# Altium project MAIN_BOARD.PrjPcb
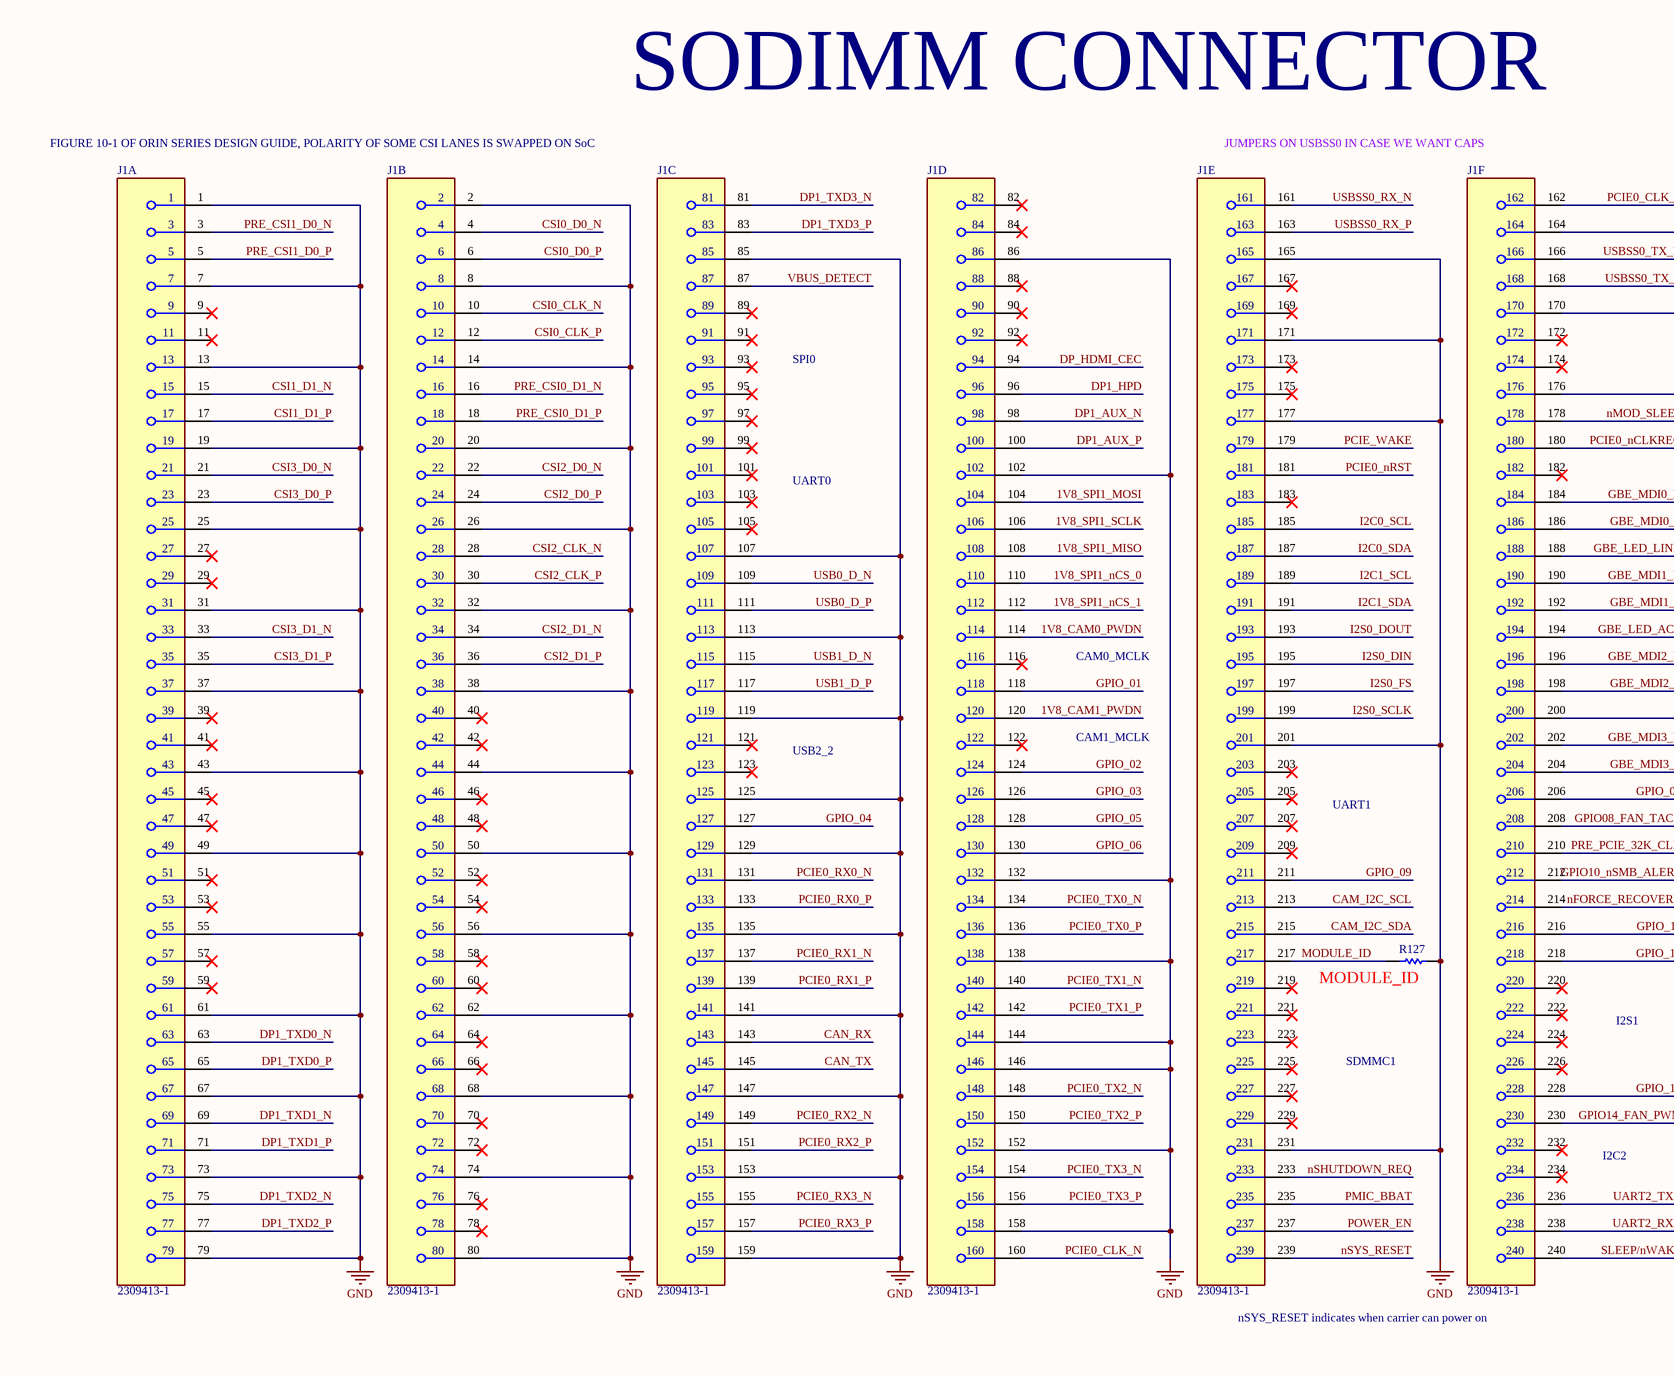
[diagram p0: JETSON.SchDoc, top left]
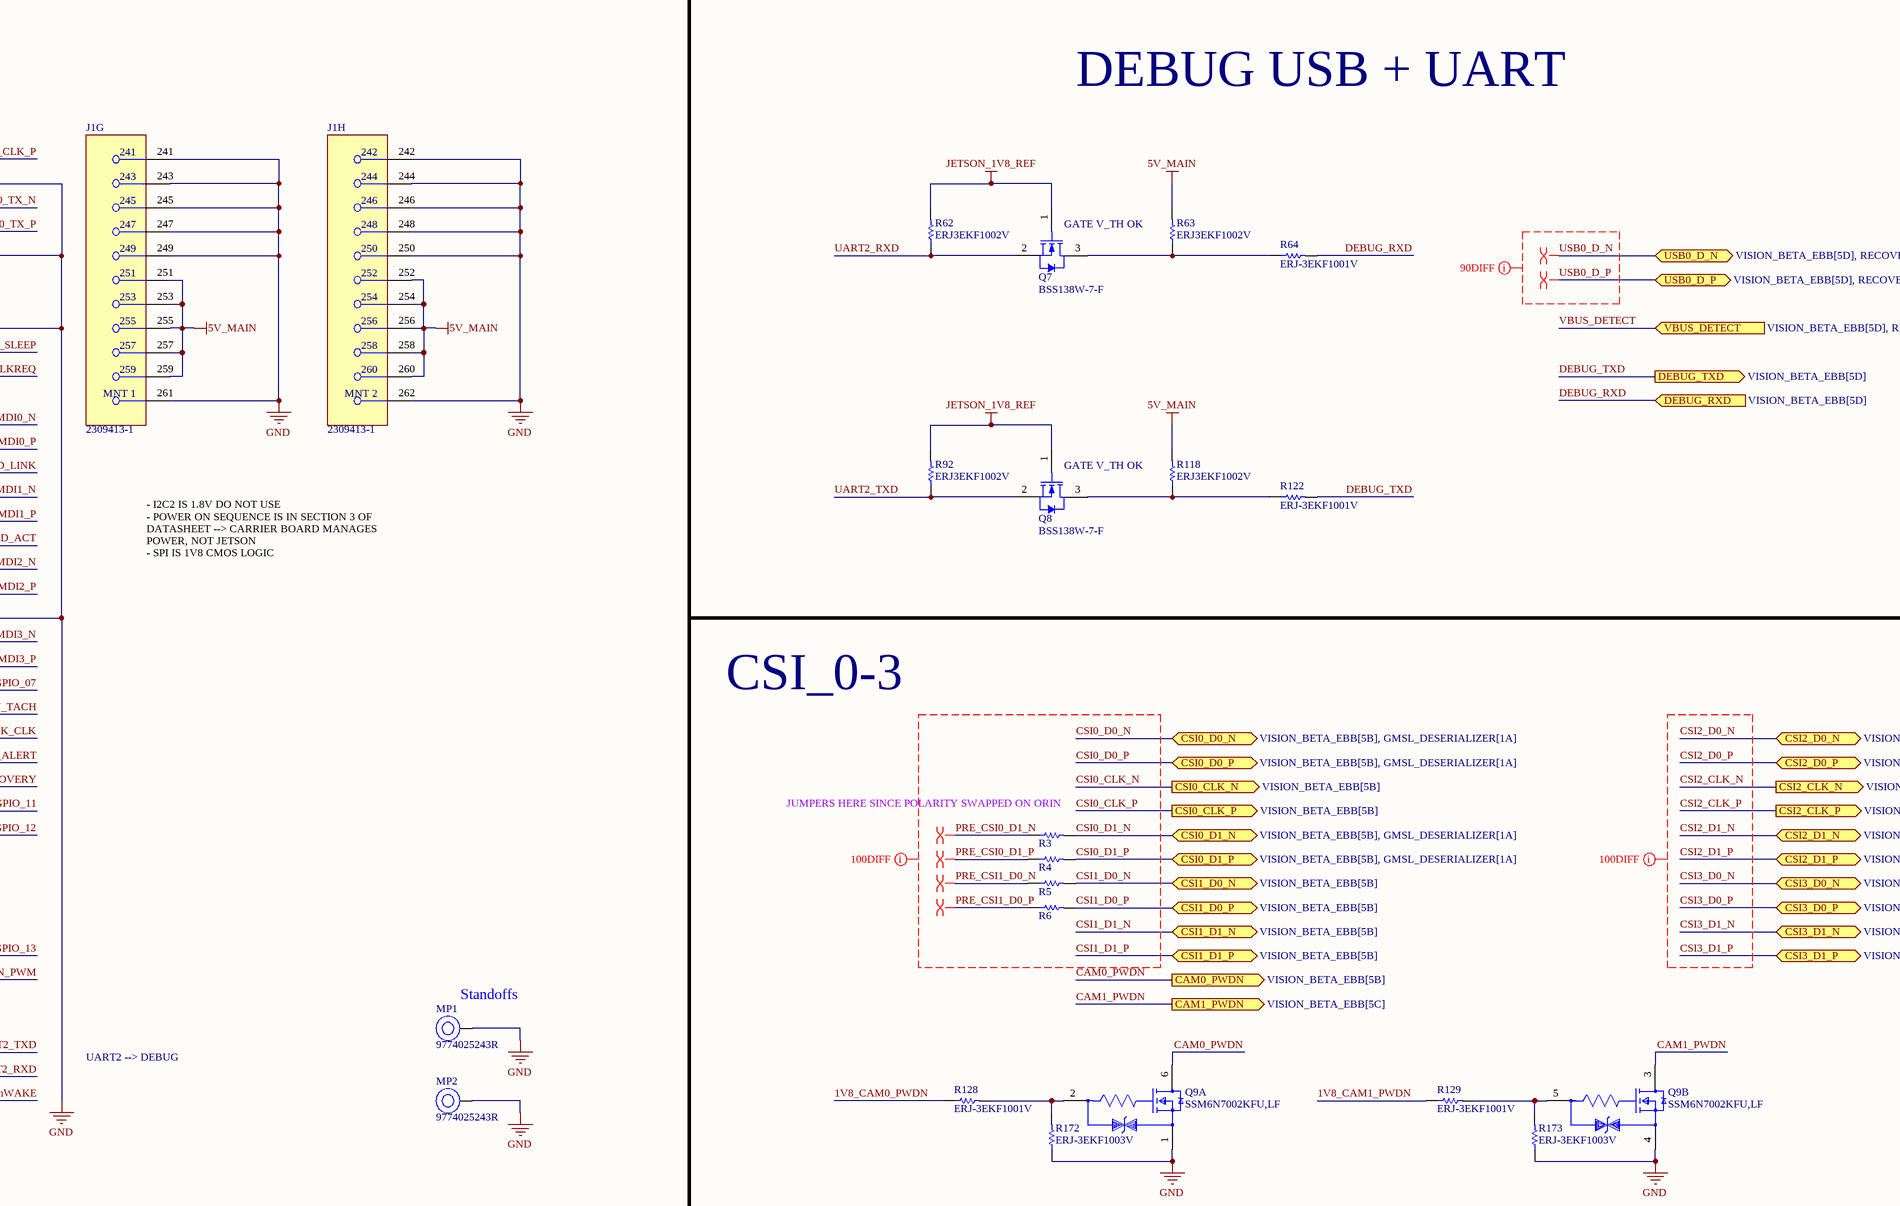
[diagram p1: JETSON.SchDoc, top middle]
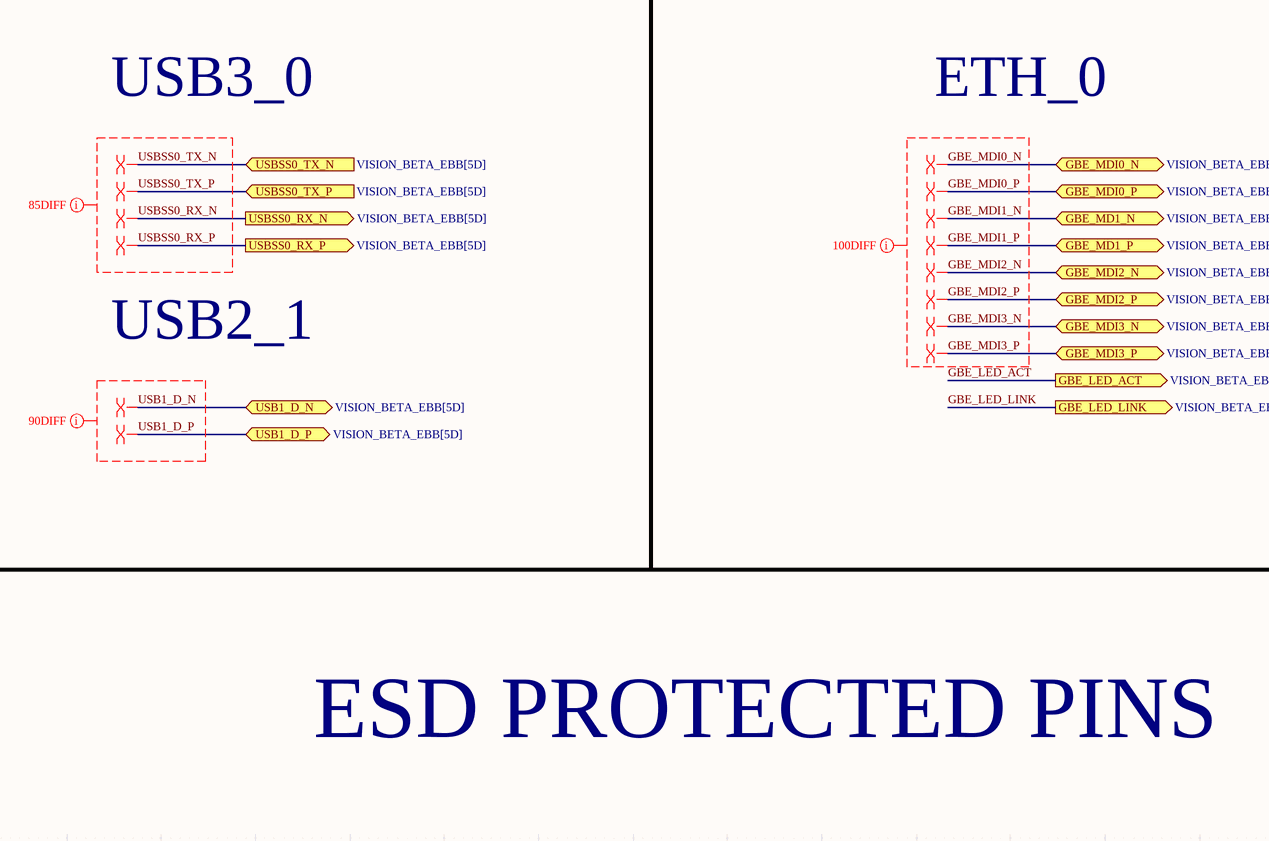
[diagram p2: JETSON.SchDoc, top right]
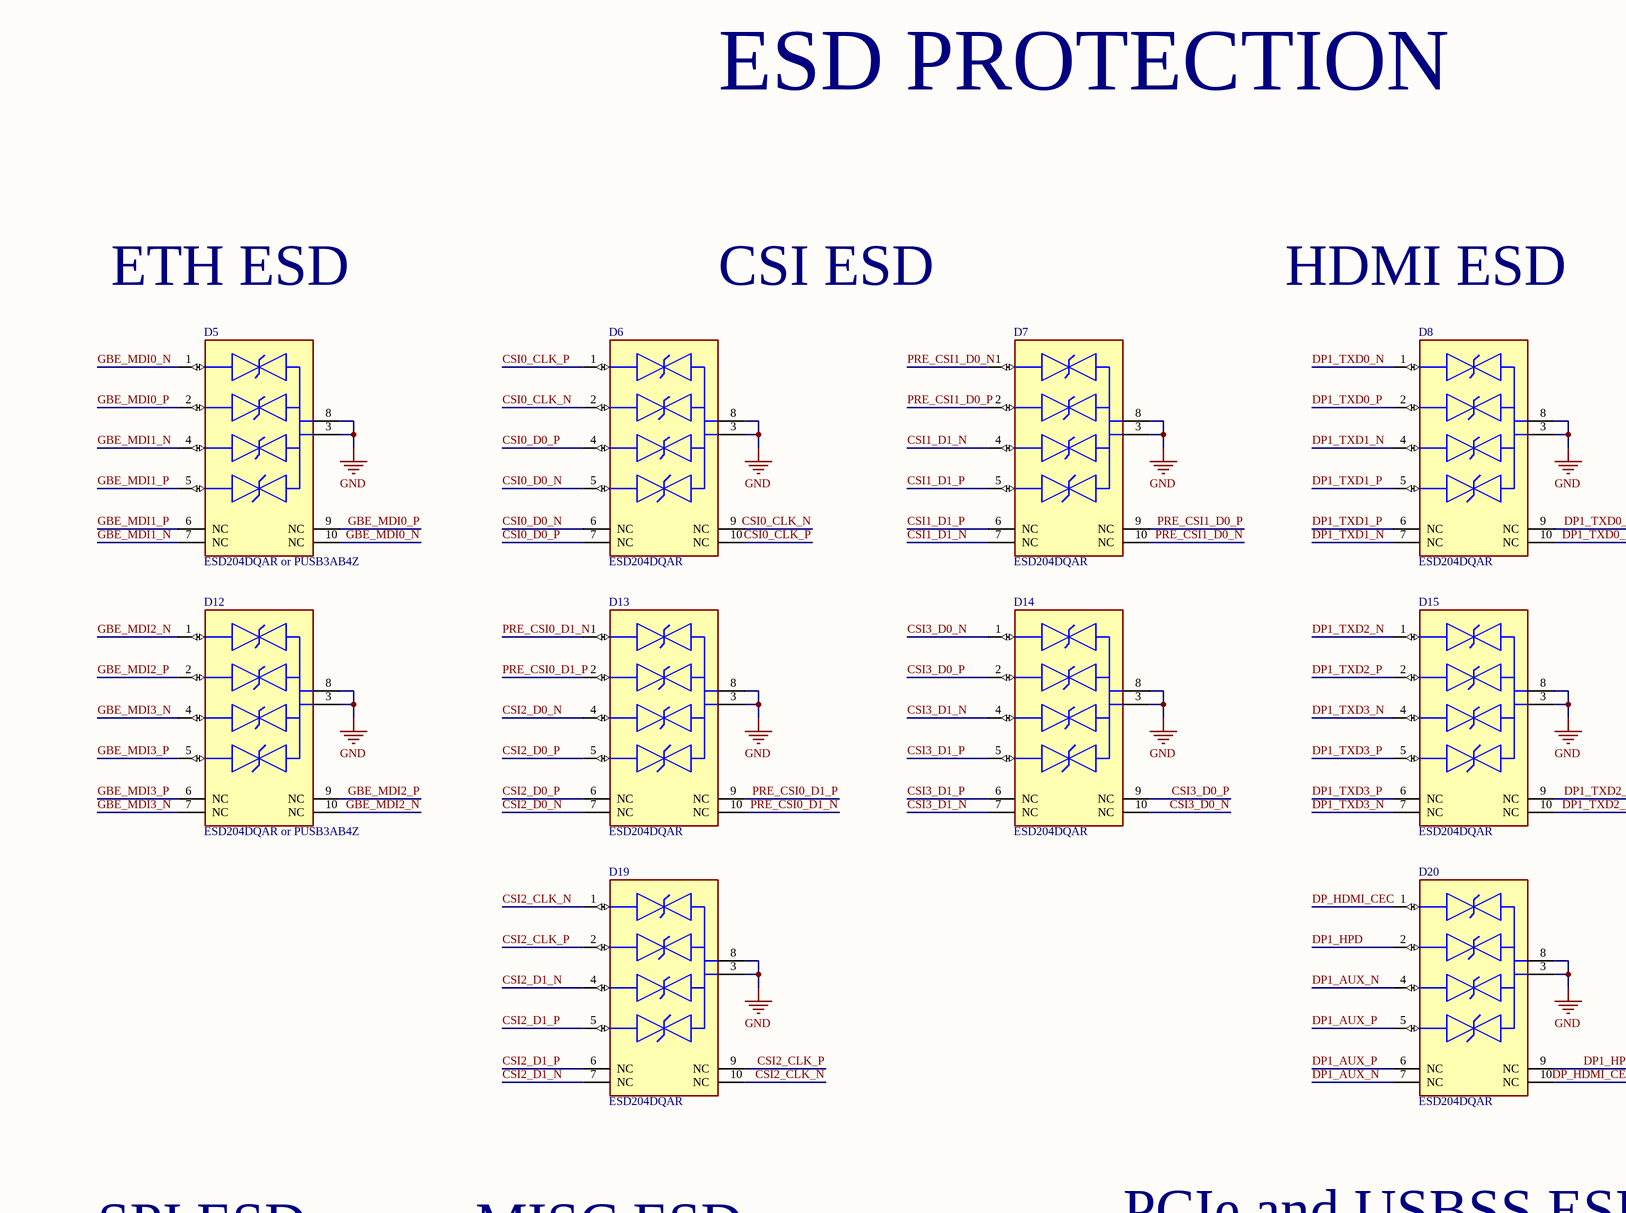
[diagram p3: JETSON.SchDoc, centre left]
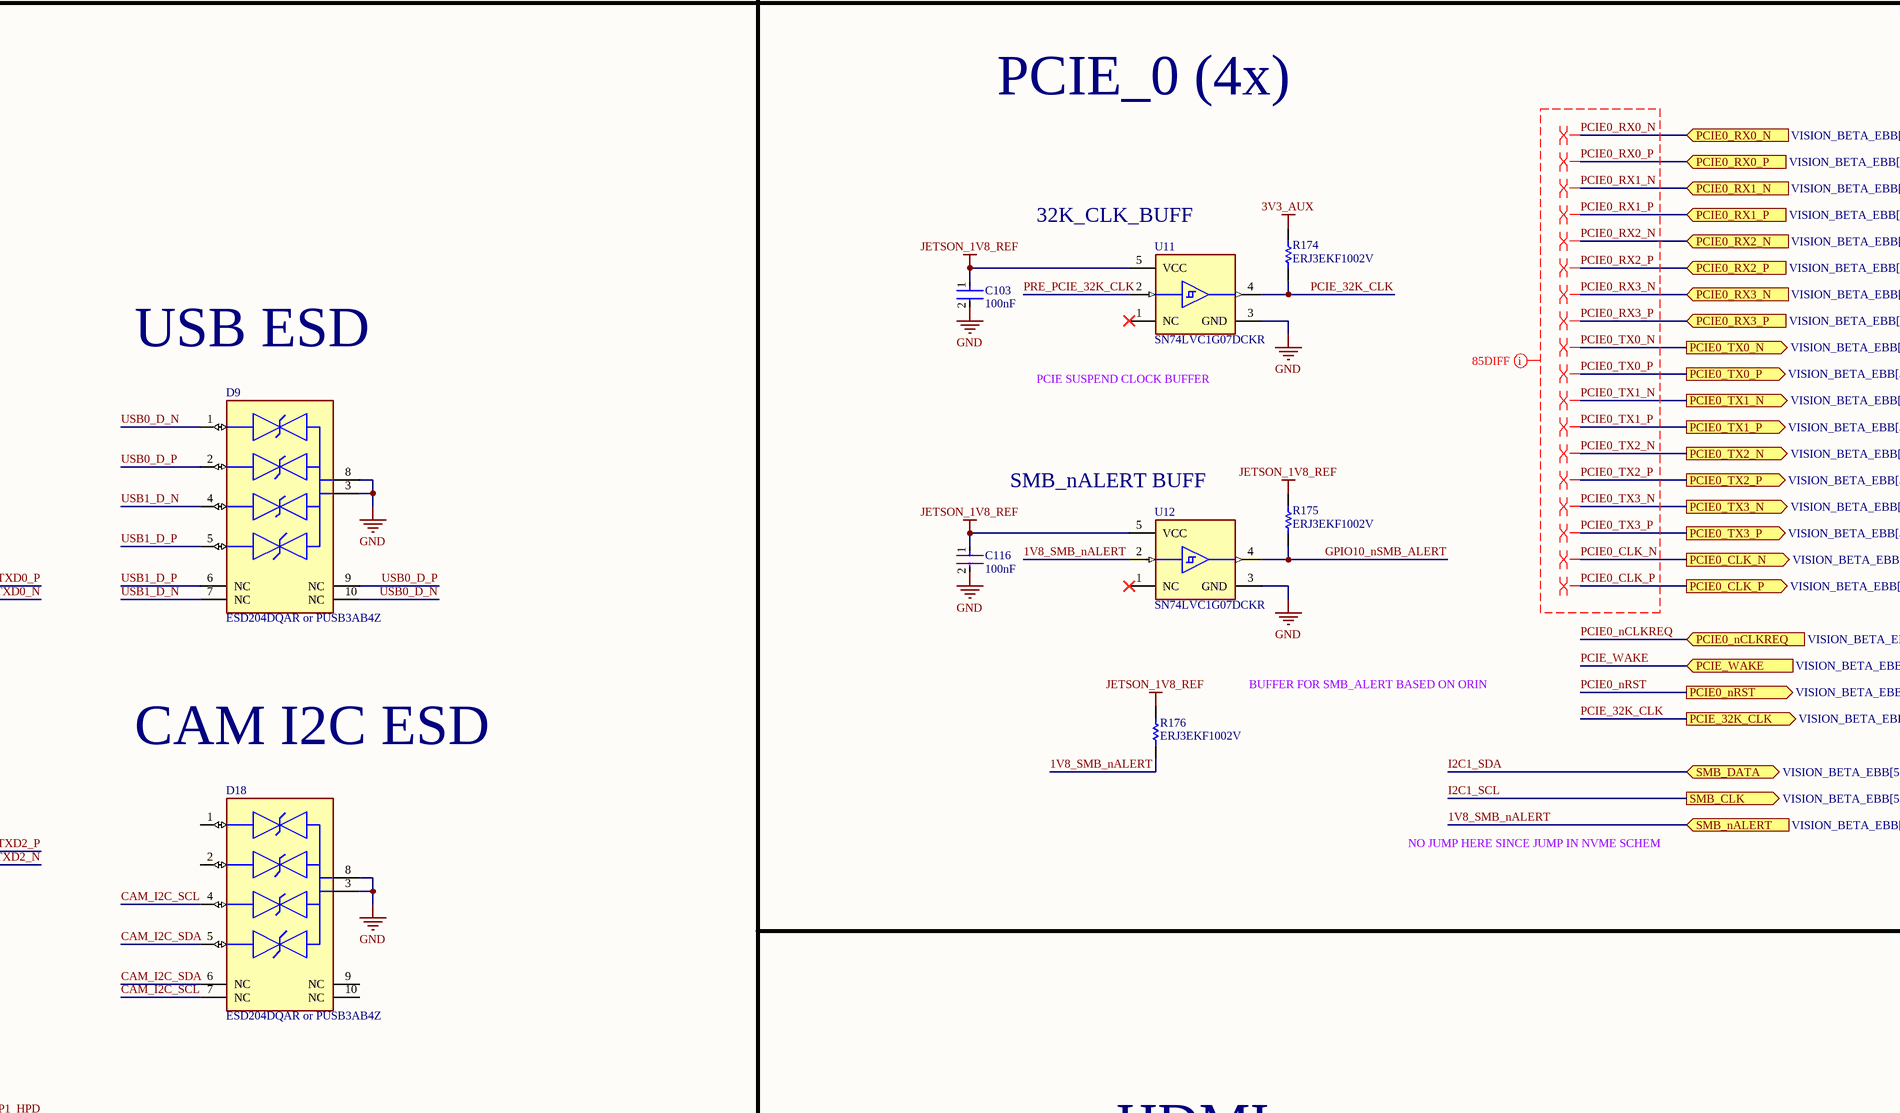
[diagram p4: JETSON.SchDoc, centre middle]
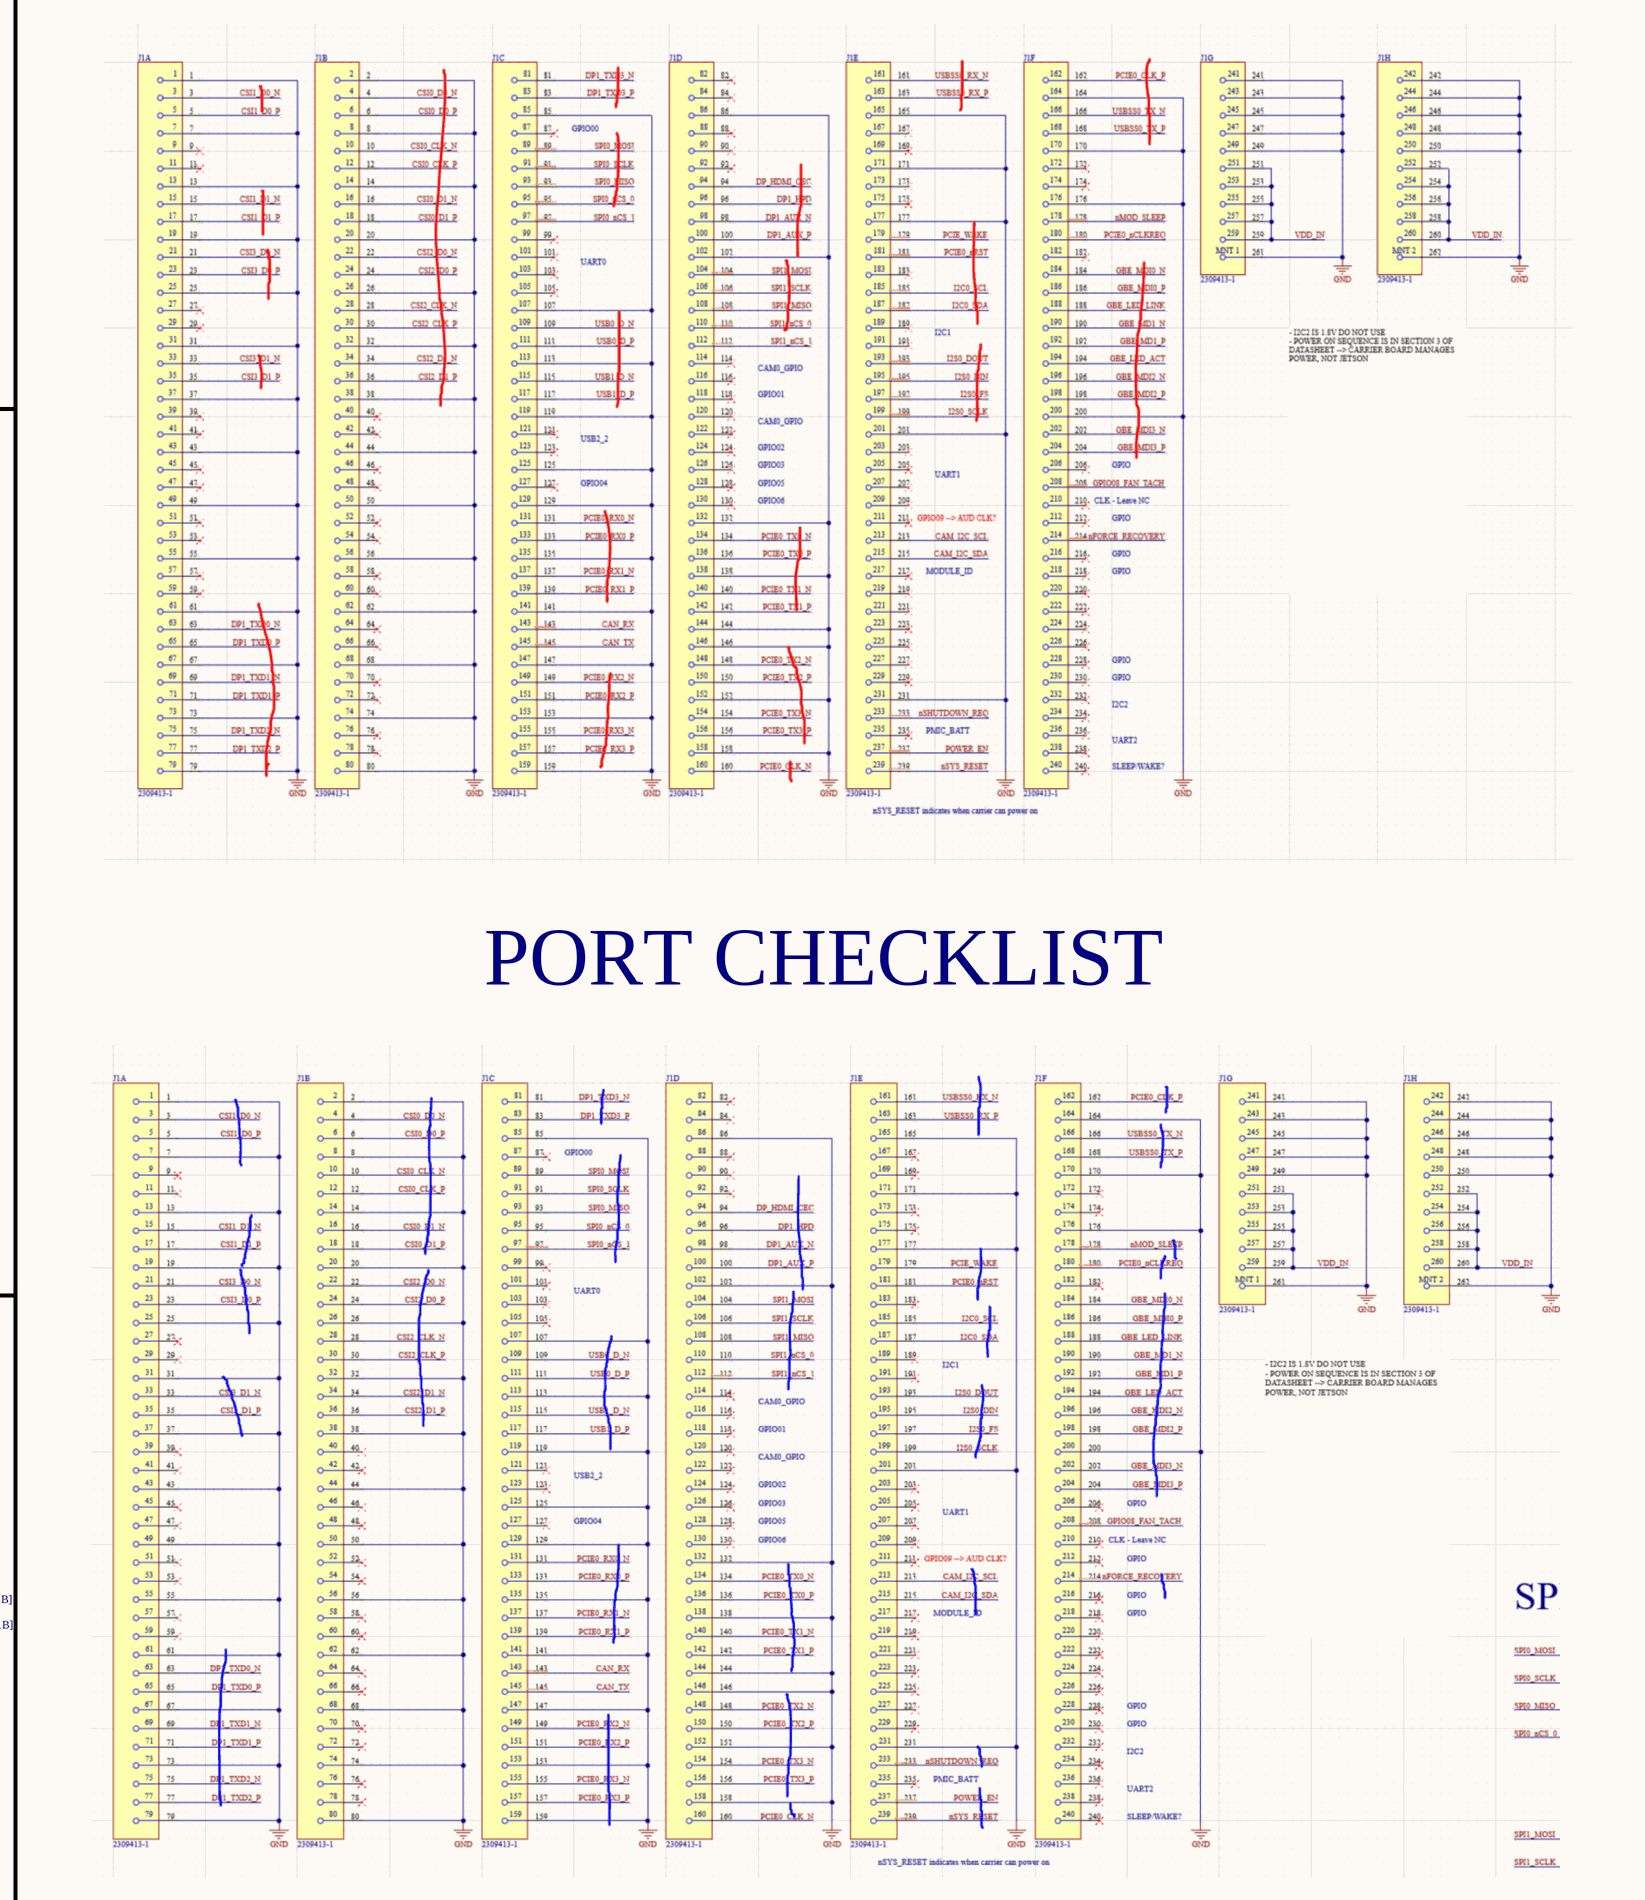
[diagram p5: JETSON.SchDoc, centre right]
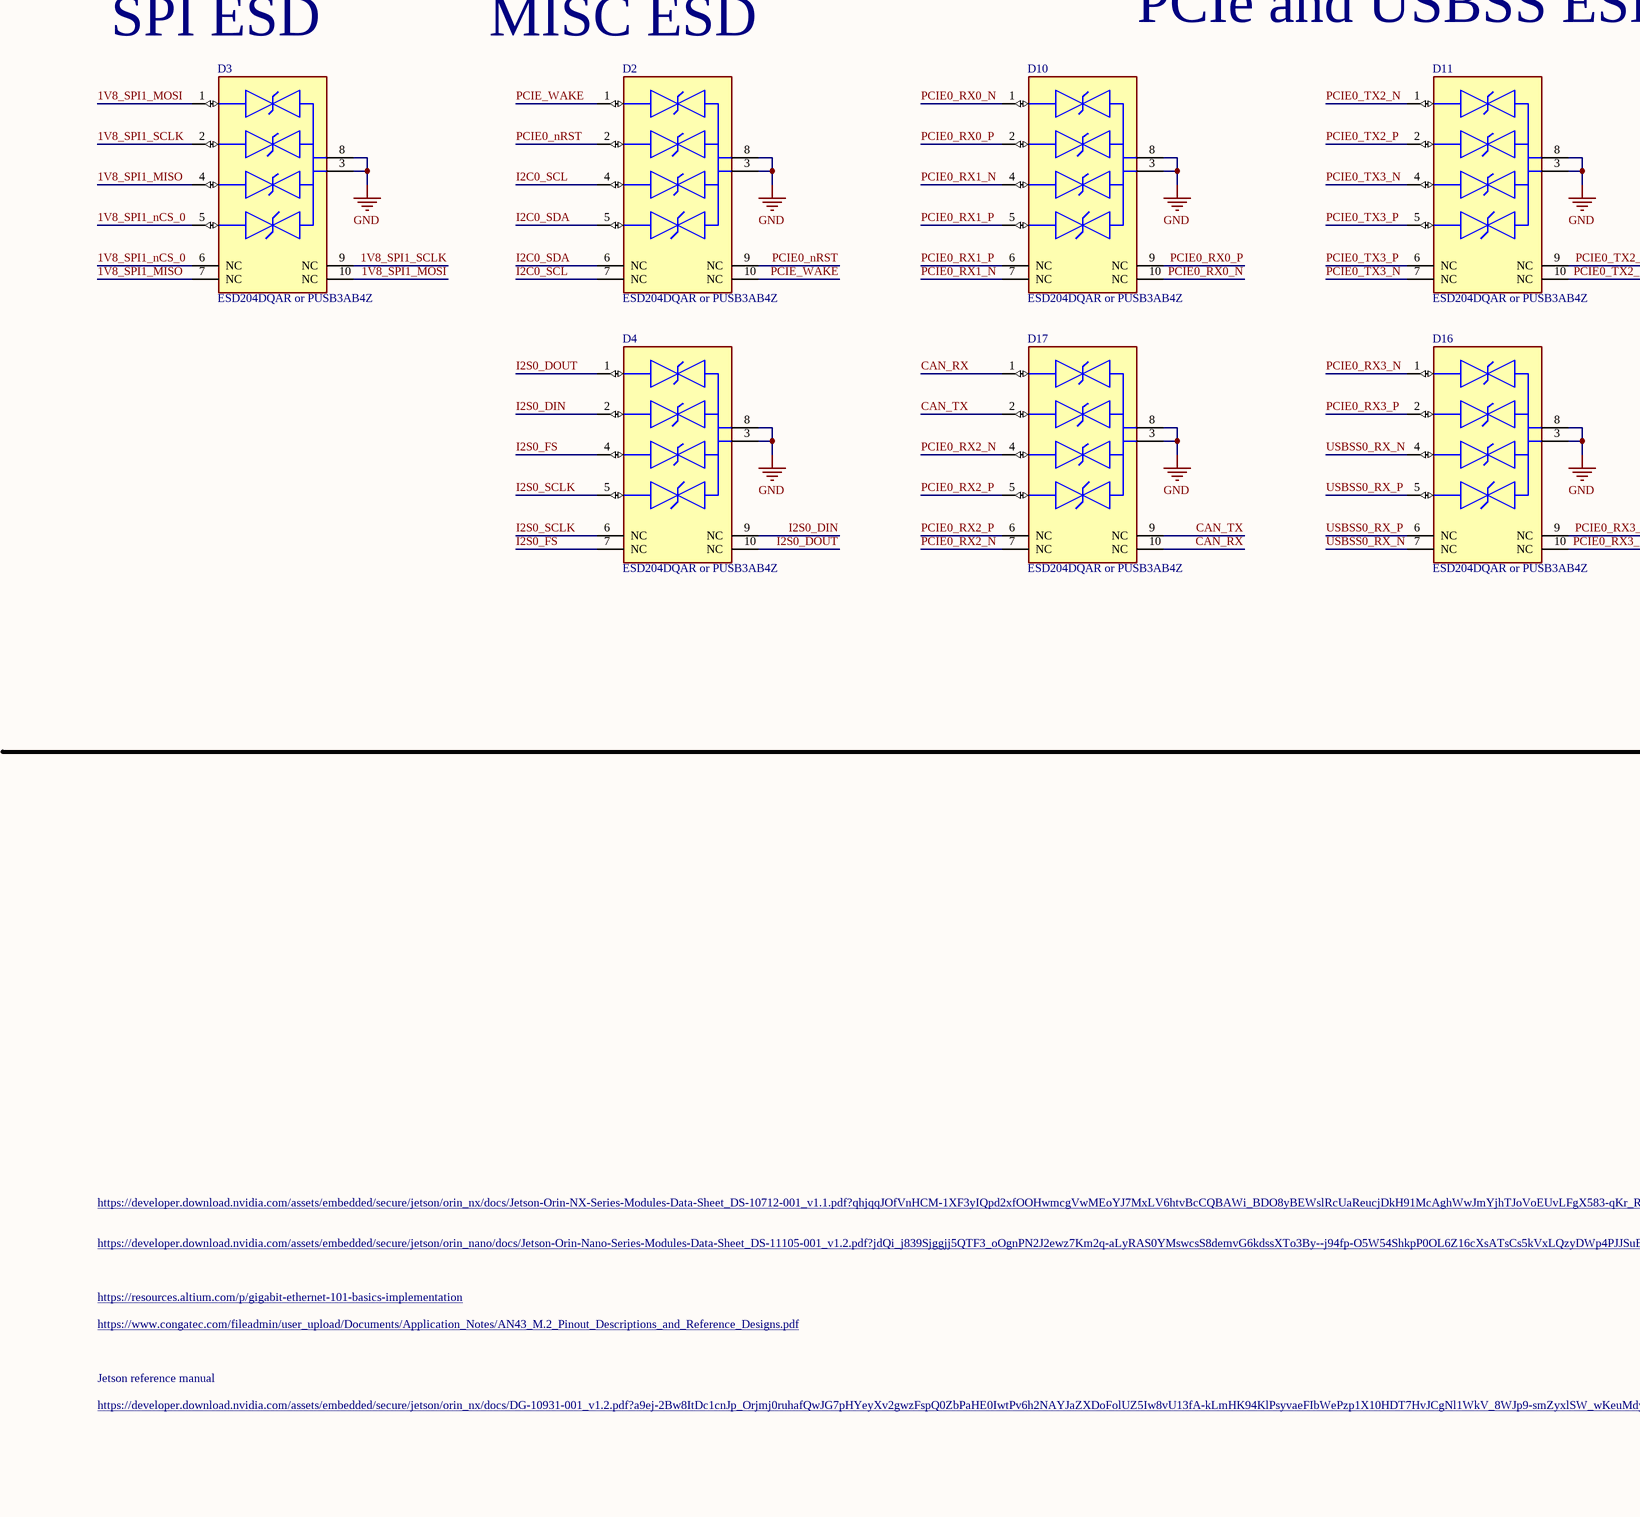
[diagram p6: JETSON.SchDoc, bottom left]
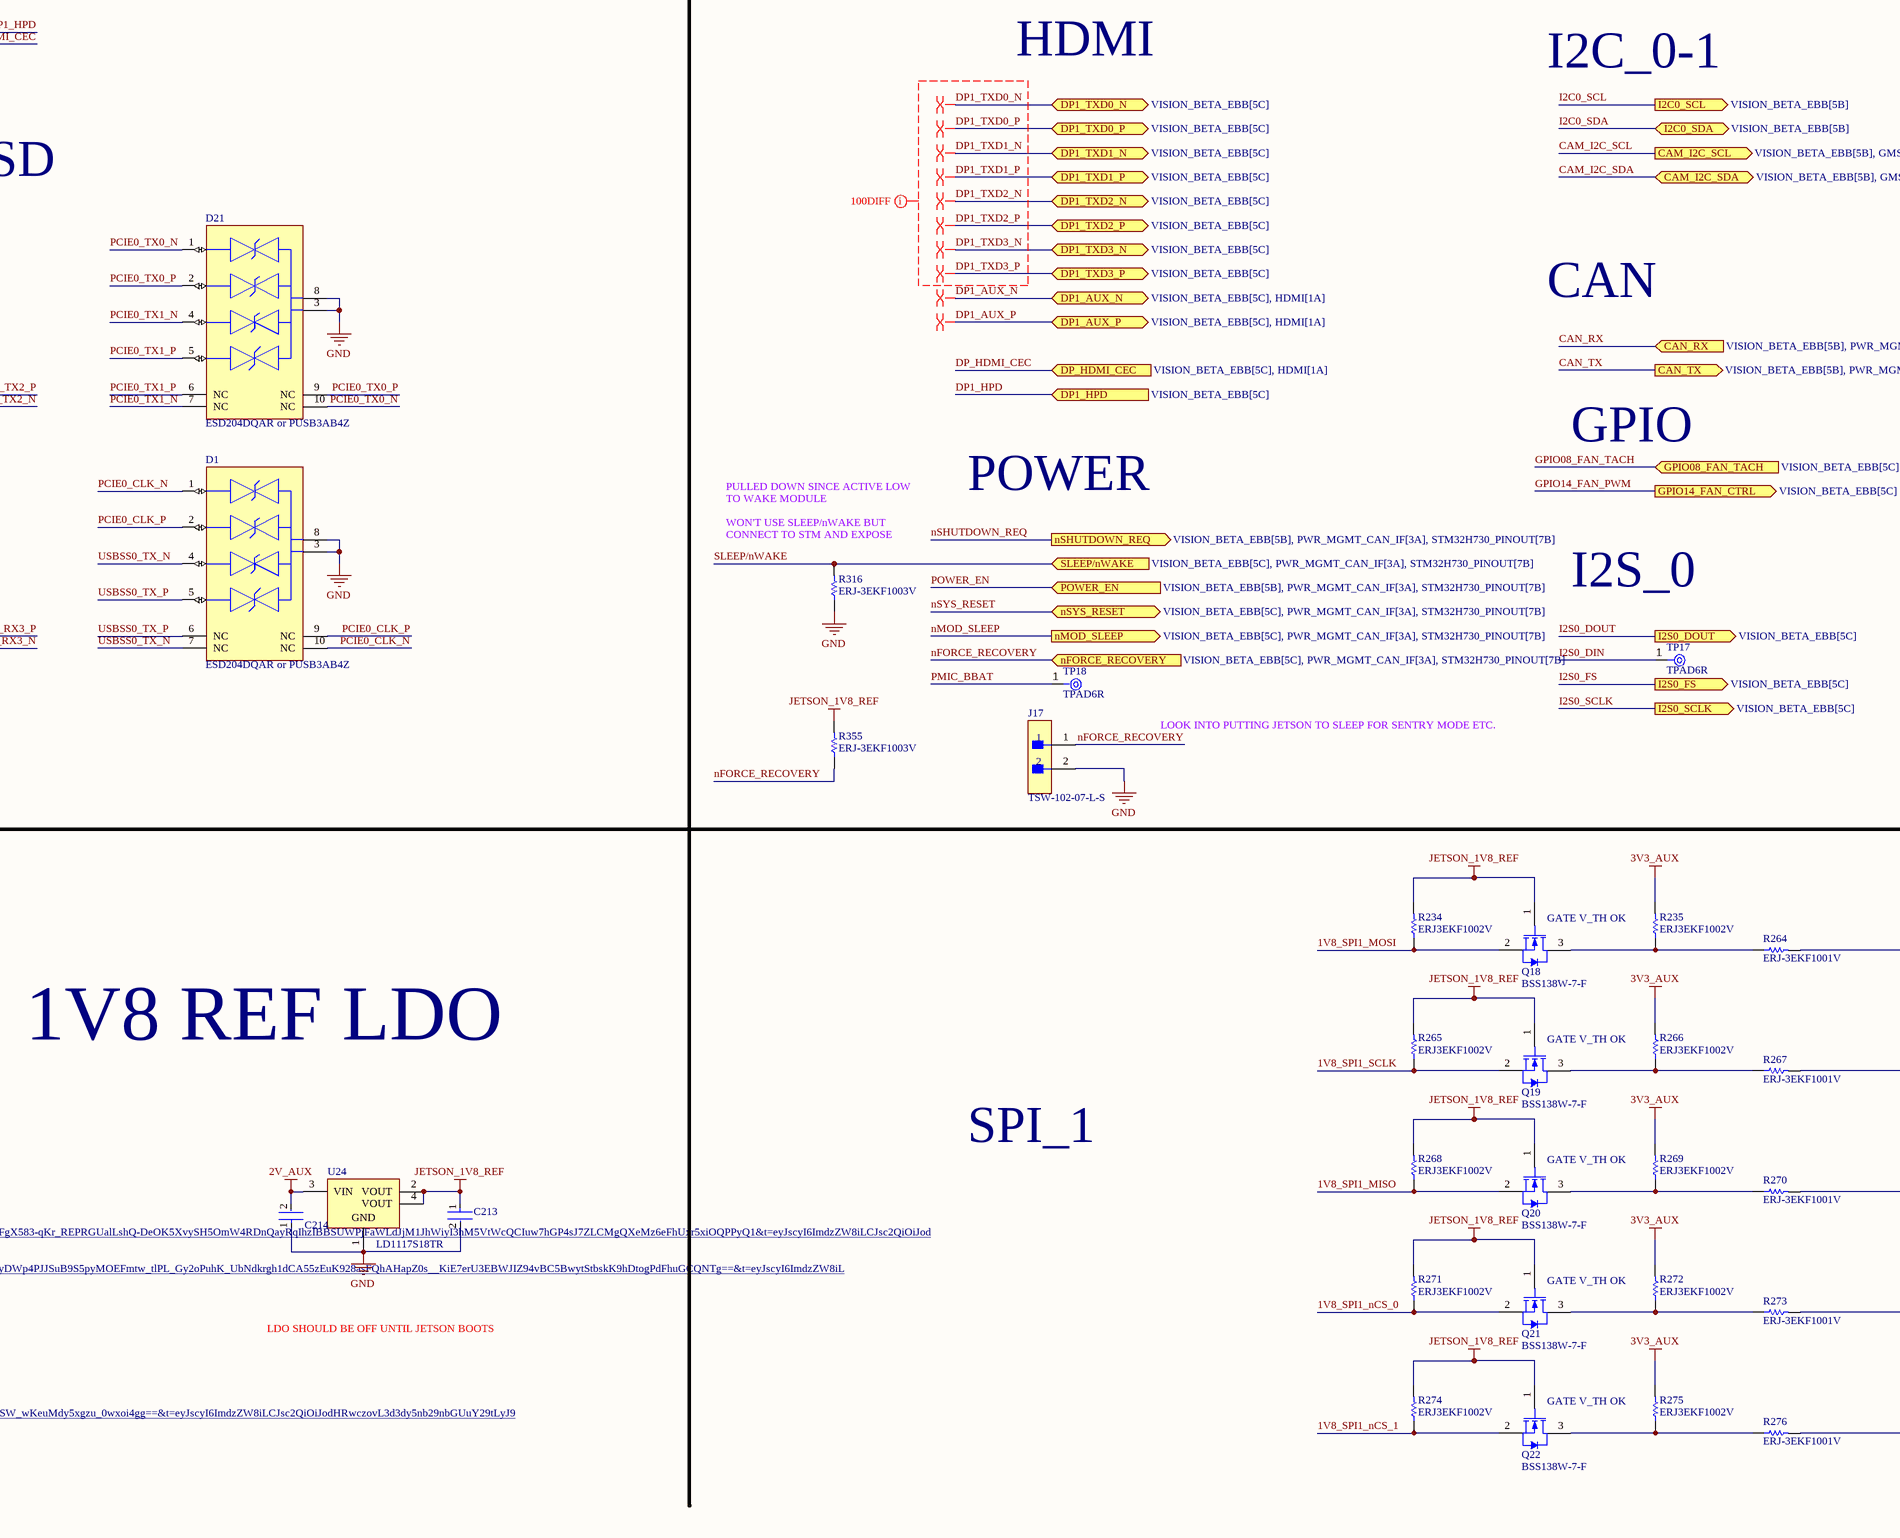
[diagram p7: JETSON.SchDoc, bottom middle]
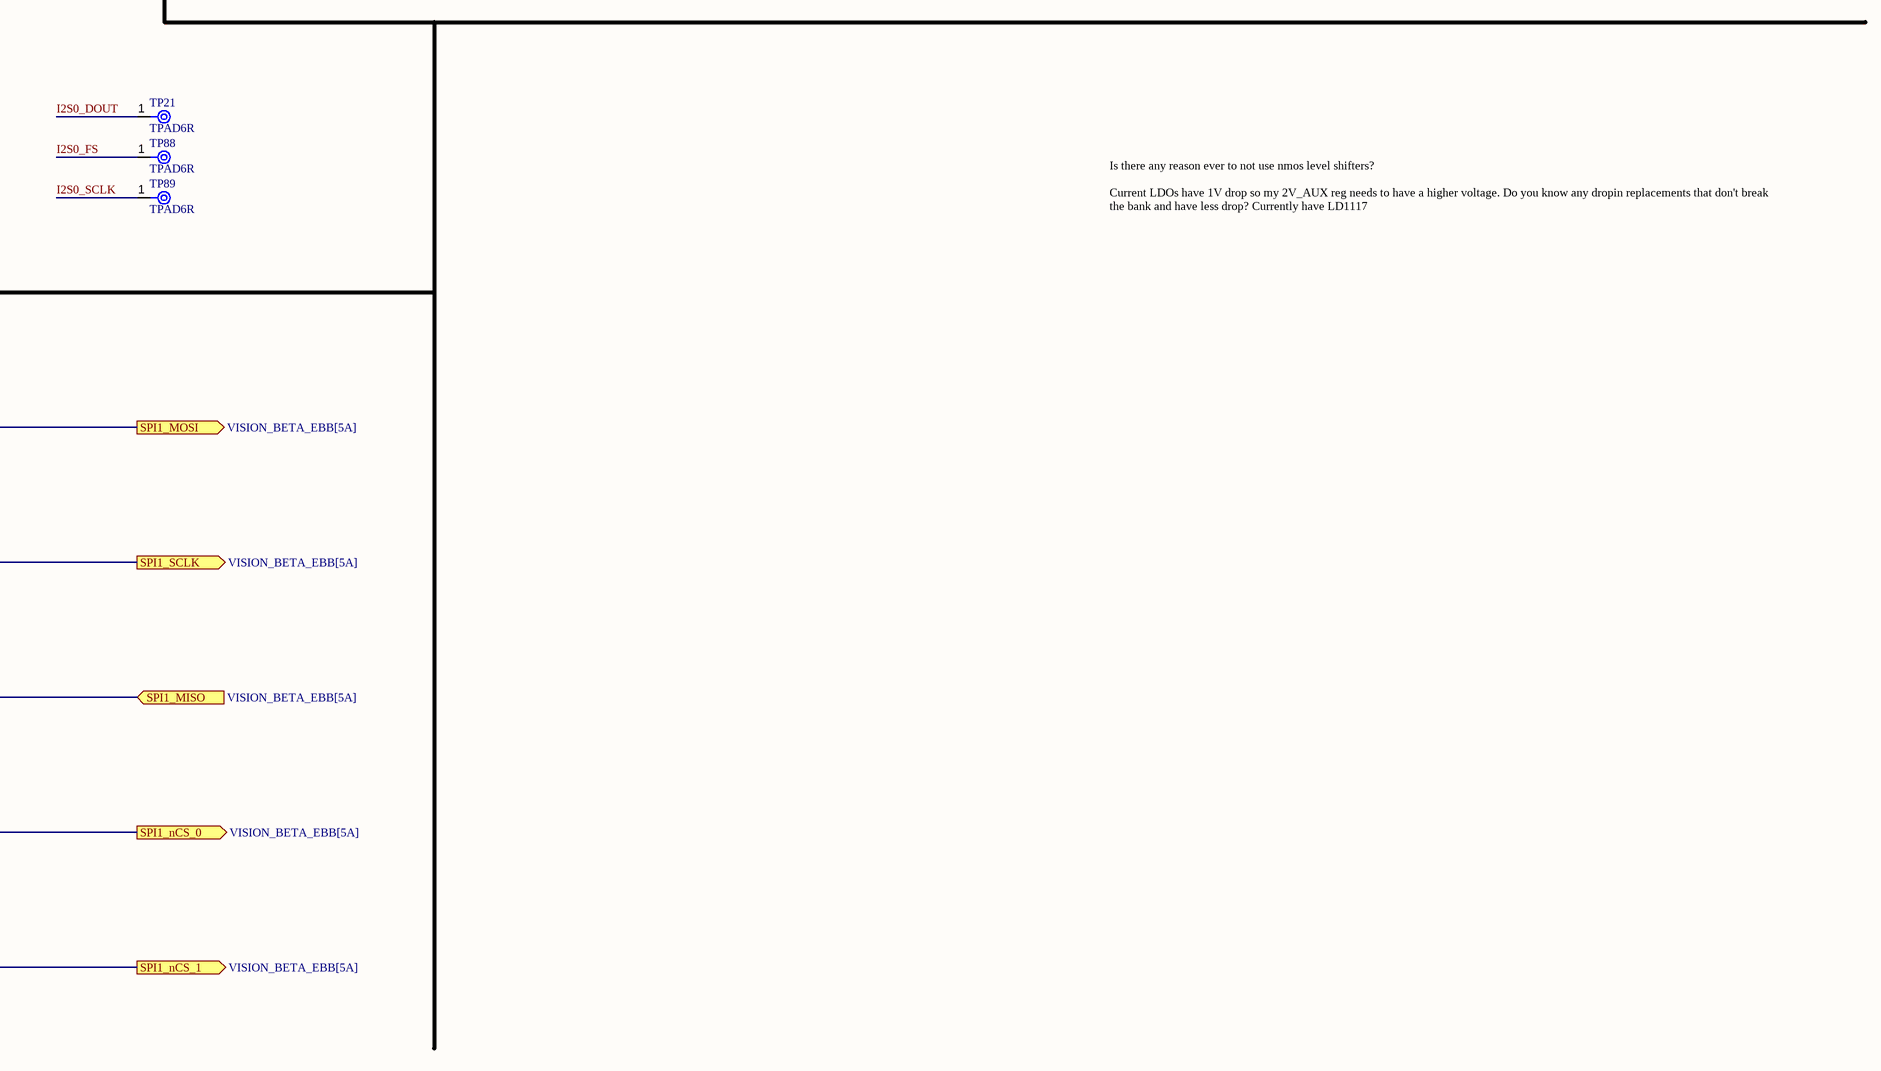
[diagram p8: JETSON.SchDoc, bottom right]
2 sheets, 126 parts. Net scope: flat (ports and power ports of the same name join across sheets).
Sheets:
  JETSON.SchDoc
  NVME.SchDoc

## Sheet JETSON.SchDoc
size E; SheetNumber: 2; SheetTotal: 19

### Parts
C103  100nF  [FP-0402-L_1_0_0_05-W_0_5-IPC_A]
C116  100nF  [FP-0402-L_1_0_0_05-W_0_5-IPC_A]
C213  GRM188R60J106ME47D  [FP-GRM188-0_1-e0_2_0_55-IPC_A]  (value not drawn)
C214  C1005X7R1H104K050BB  [FP-C1005-050-0_05-IPC_C]  (value not drawn)
D1  ESD204DQAR or PUSB3AB4Z  [FP-DQA0010A-MFG]
D2  ESD204DQAR or PUSB3AB4Z  [FP-DQA0010A-MFG]
D3  ESD204DQAR or PUSB3AB4Z  [FP-DQA0010A-MFG]
D4  ESD204DQAR or PUSB3AB4Z  [FP-DQA0010A-MFG]
D5  ESD204DQAR or PUSB3AB4Z  [FP-DQA0010A-MFG]
D6  ESD204DQAR  [FP-DQA0010A-MFG]
D7  ESD204DQAR  [FP-DQA0010A-MFG]
D8  ESD204DQAR  [FP-DQA0010A-MFG]
D9  ESD204DQAR or PUSB3AB4Z  [FP-DQA0010A-MFG]
D10  ESD204DQAR or PUSB3AB4Z  [FP-DQA0010A-MFG]
D11  ESD204DQAR or PUSB3AB4Z  [FP-DQA0010A-MFG]
D12  ESD204DQAR or PUSB3AB4Z  [FP-DQA0010A-MFG]
D13  ESD204DQAR  [FP-DQA0010A-MFG]
D14  ESD204DQAR  [FP-DQA0010A-MFG]
D15  ESD204DQAR  [FP-DQA0010A-MFG]
D16  ESD204DQAR or PUSB3AB4Z  [FP-DQA0010A-MFG]
D17  ESD204DQAR or PUSB3AB4Z  [FP-DQA0010A-MFG]
D18  ESD204DQAR or PUSB3AB4Z  [FP-DQA0010A-MFG]
D19  ESD204DQAR  [FP-DQA0010A-MFG]
D20  ESD204DQAR  [FP-DQA0010A-MFG]
D21  ESD204DQAR or PUSB3AB4Z  [FP-DQA0010A-MFG]
J1  2309413-1  [FP-2309413-1-MFG]  (parts A,B,C,D,E,F,G,H of 8)
J17  TSW-102-07-L-S  [FP-TSW-102-07-L-S-MFG]
MP1  9774025243R  [9774025243]
MP2  9774025243R  [9774025243]
Q7  BSS138W-7-F  [DIOD-SOT323-3_V]
Q8  BSS138W-7-F  [DIOD-SOT323-3_V]
Q9  SSM6N7002KFU,LF  [FP-SSOP6-P-0_65A-MFG]  (parts A,B of 2)
Q18  BSS138W-7-F  [DIOD-SOT323-3_V]
Q19  BSS138W-7-F  [DIOD-SOT323-3_V]
Q20  BSS138W-7-F  [DIOD-SOT323-3_V]
Q21  BSS138W-7-F  [DIOD-SOT323-3_V]
Q22  BSS138W-7-F  [DIOD-SOT323-3_V]
R3  0402 JUMPER  [RESC1005X40X25ML05T05]  (value not drawn)
R4  0402 JUMPER  [RESC1005X40X25ML05T05]  (value not drawn)
R5  0402 JUMPER  [RESC1005X40X25ML05T05]  (value not drawn)
R6  0402 JUMPER  [RESC1005X40X25ML05T05]  (value not drawn)
R62  ERJ3EKF1002V  [RESC1609X55X30LL15T15]
R63  ERJ3EKF1002V  [RESC1609X55X30LL15T15]
R64  ERJ-3EKF1001V  [RESC1608X55X30LL15T15]
R92  ERJ3EKF1002V  [RESC1609X55X30LL15T15]
R118  ERJ3EKF1002V  [RESC1609X55X30LL15T15]
R122  ERJ-3EKF1001V  [RESC1608X55X30LL15T15]
R127  0402 JUMPER  [RESC1005X40X25ML05T05]  (value not drawn)
R128  ERJ-3EKF1001V  [RESC1608X55X30LL15T15]
R129  ERJ-3EKF1001V  [RESC1608X55X30LL15T15]
R172  ERJ-3EKF1003V  [RESC1608X55X30ML15T15]
R173  ERJ-3EKF1003V  [RESC1608X55X30ML15T15]
R174  ERJ3EKF1002V  [RESC1609X55X30LL15T15]
R175  ERJ3EKF1002V  [RESC1609X55X30LL15T15]
R176  ERJ3EKF1002V  [RESC1609X55X30LL15T15]
R234  ERJ3EKF1002V  [RESC1609X55X30LL15T15]
R235  ERJ3EKF1002V  [RESC1609X55X30LL15T15]
R264  ERJ-3EKF1001V  [RESC1608X55X30LL15T15]
R265  ERJ3EKF1002V  [RESC1609X55X30LL15T15]
R266  ERJ3EKF1002V  [RESC1609X55X30LL15T15]
R267  ERJ-3EKF1001V  [RESC1608X55X30LL15T15]
R268  ERJ3EKF1002V  [RESC1609X55X30LL15T15]
R269  ERJ3EKF1002V  [RESC1609X55X30LL15T15]
R270  ERJ-3EKF1001V  [RESC1608X55X30LL15T15]
R271  ERJ3EKF1002V  [RESC1609X55X30LL15T15]
R272  ERJ3EKF1002V  [RESC1609X55X30LL15T15]
R273  ERJ-3EKF1001V  [RESC1608X55X30LL15T15]
R274  ERJ3EKF1002V  [RESC1609X55X30LL15T15]
R275  ERJ3EKF1002V  [RESC1609X55X30LL15T15]
R276  ERJ-3EKF1001V  [RESC1608X55X30LL15T15]
R316  ERJ-3EKF1003V  [RESC1608X55X30ML15T15]
R355  ERJ-3EKF1003V  [RESC1608X55X30ML15T15]
TP17  TPAD6R  [New footprint 1]
TP18  TPAD6R  [New footprint 1]
TP21  TPAD6R  [New footprint 1]
TP88  TPAD6R  [New footprint 1]
TP89  TPAD6R  [New footprint 1]
U11  SN74LVC1G07DCKR  [FP-DCK0005A-IPC_C]
U12  SN74LVC1G07DCKR  [FP-DCK0005A-IPC_C]
U24  LD1117S18TR  [SOT-223_M]

### Ports
CAM0_PWDN (out, see VISION_BETA_EBB[5B]), CAM1_PWDN (out, see VISION_BETA_EBB[5C]), CAM_I2C_SCL (out, see VISION_BETA_EBB[5B], GMSL_DESERIALIZER[1B]), CAM_I2C_SDA (bidir, see VISION_BETA_EBB[5B], GMSL_DESERIALIZER[1B]), CAN_RX (in, see VISION_BETA_EBB[5B], PWR_MGMT_CAN_IF[1C]), CAN_TX (out, see VISION_BETA_EBB[5B], PWR_MGMT_CAN_IF[1C]), CSI0_CLK_N (out, see VISION_BETA_EBB[5B]), CSI0_CLK_P (out, see VISION_BETA_EBB[5B]), CSI0_D0_N (bidir, see VISION_BETA_EBB[5B], GMSL_DESERIALIZER[1A]), CSI0_D0_P (bidir, see VISION_BETA_EBB[5B], GMSL_DESERIALIZER[1A]), CSI0_D1_N (bidir, see VISION_BETA_EBB[5B], GMSL_DESERIALIZER[1A]), CSI0_D1_P (bidir, see VISION_BETA_EBB[5B], GMSL_DESERIALIZER[1A]), CSI1_D0_N (bidir, see VISION_BETA_EBB[5B]), CSI1_D0_P (bidir, see VISION_BETA_EBB[5B]), CSI1_D1_N (bidir, see VISION_BETA_EBB[5B]), CSI1_D1_P (bidir, see VISION_BETA_EBB[5B]), CSI2_CLK_N (out, see VISION_BETA_EBB[5C]), CSI2_CLK_P (out, see VISION_BETA_EBB[5C]), CSI2_D0_N (bidir, see VISION_BETA_EBB[5B]), CSI2_D0_P (bidir, see VISION_BETA_EBB[5B]), CSI2_D1_N (bidir, see VISION_BETA_EBB[5B]), CSI2_D1_P (bidir, see VISION_BETA_EBB[5B]), CSI3_D0_N (bidir, see VISION_BETA_EBB[5B]), CSI3_D0_P (bidir, see VISION_BETA_EBB[5B]), CSI3_D1_N (bidir, see VISION_BETA_EBB[5B]), CSI3_D1_P (bidir, see VISION_BETA_EBB[5B]), DEBUG_RXD (in, see VISION_BETA_EBB[5D]), DEBUG_TXD (out, see VISION_BETA_EBB[5D]), DP1_AUX_N (bidir, see VISION_BETA_EBB[5C], HDMI[1A]), DP1_AUX_P (bidir, see VISION_BETA_EBB[5C], HDMI[1A]), DP1_HPD (in, see VISION_BETA_EBB[5C]), DP1_TXD0_N (bidir, see VISION_BETA_EBB[5C]), DP1_TXD0_P (bidir, see VISION_BETA_EBB[5C]), DP1_TXD1_N (bidir, see VISION_BETA_EBB[5C]), DP1_TXD1_P (bidir, see VISION_BETA_EBB[5C]), DP1_TXD2_N (bidir, see VISION_BETA_EBB[5C]), DP1_TXD2_P (bidir, see VISION_BETA_EBB[5C]), DP1_TXD3_N (bidir, see VISION_BETA_EBB[5C]), DP1_TXD3_P (bidir, see VISION_BETA_EBB[5C]), DP_HDMI_CEC (in, see VISION_BETA_EBB[5C], HDMI[1A]), GBE_LED_ACT (out, see VISION_BETA_EBB[5C], ETHERNET[1B]), GBE_LED_LINK (out, see VISION_BETA_EBB[5C], ETHERNET[1B]), GBE_MD1_N (bidir, see VISION_BETA_EBB[5C]), GBE_MD1_P (bidir, see VISION_BETA_EBB[5C]), GBE_MDI0_N (bidir, see VISION_BETA_EBB[5C], ETHERNET[1A]), GBE_MDI0_P (bidir, see VISION_BETA_EBB[5C], ETHERNET[1A]), GBE_MDI2_N (bidir, see VISION_BETA_EBB[5C], ETHERNET[1A]), GBE_MDI2_P (bidir, see VISION_BETA_EBB[5C], ETHERNET[1A]), GBE_MDI3_N (bidir, see VISION_BETA_EBB[5C], ETHERNET[1B]), GBE_MDI3_P (bidir, see VISION_BETA_EBB[5C], ETHERNET[1A]), GPIO08_FAN_TACH (in, see VISION_BETA_EBB[5C]), GPIO14_FAN_CTRL (out, see VISION_BETA_EBB[5C]), I2C0_SCL (out, see VISION_BETA_EBB[5B]), I2C0_SDA (bidir, see VISION_BETA_EBB[5B]), I2S0_DOUT (out, see VISION_BETA_EBB[5C]), I2S0_FS (out, see VISION_BETA_EBB[5C]), I2S0_SCLK (out, see VISION_BETA_EBB[5C]), nFORCE_RECOVERY (in, see VISION_BETA_EBB[5C], PWR_MGMT_CAN_IF[3A], STM32H730_PINOUT[7B]), nMOD_SLEEP (out, see VISION_BETA_EBB[5C], PWR_MGMT_CAN_IF[3A], STM32H730_PINOUT[7B]), nSHUTDOWN_REQ (out, see VISION_BETA_EBB[5B], PWR_MGMT_CAN_IF[3A], STM32H730_PINOUT[7B]), nSYS_RESET (bidir, see VISION_BETA_EBB[5C], PWR_MGMT_CAN_IF[3A], STM32H730_PINOUT[7B]), PCIE0_CLK_N (out, see VISION_BETA_EBB[5A], NVME[6B]), PCIE0_CLK_P (out, see VISION_BETA_EBB[5A], NVME[6B]), PCIE0_nCLKREQ (in, see VISION_BETA_EBB[5A]), PCIE0_nRST (out, see VISION_BETA_EBB[5A]), PCIE0_RX0_N (in, see VISION_BETA_EBB[5B]), PCIE0_RX0_P (in, see VISION_BETA_EBB[5B]), PCIE0_RX1_N (in, see VISION_BETA_EBB[5B]), PCIE0_RX1_P (in, see VISION_BETA_EBB[5B]), PCIE0_RX2_N (in, see VISION_BETA_EBB[5B]), PCIE0_RX2_P (in, see VISION_BETA_EBB[5B]), PCIE0_RX3_N (in, see VISION_BETA_EBB[5B]), PCIE0_RX3_P (in, see VISION_BETA_EBB[5B]), PCIE0_TX0_N (out, see VISION_BETA_EBB[5A]), PCIE0_TX0_P (out, see VISION_BETA_EBB[5A]), PCIE0_TX1_N (out, see VISION_BETA_EBB[5A]), PCIE0_TX1_P (out, see VISION_BETA_EBB[5A]), PCIE0_TX2_N (out, see VISION_BETA_EBB[5A]), PCIE0_TX2_P (out, see VISION_BETA_EBB[5A]), PCIE0_TX3_N (out, see VISION_BETA_EBB[5A]), PCIE0_TX3_P (out, see VISION_BETA_EBB[5A]), PCIE_32K_CLK (out, see VISION_BETA_EBB[5A], NVME[6B]), PCIE_WAKE (in, see VISION_BETA_EBB[5A]), POWER_EN (in, see VISION_BETA_EBB[5B], PWR_MGMT_CAN_IF[3A], STM32H730_PINOUT[7B]), SLEEP/nWAKE (in, see VISION_BETA_EBB[5C], PWR_MGMT_CAN_IF[3A], STM32H730_PINOUT[7B]), SMB_CLK (out, see VISION_BETA_EBB[5B], NVME[6B]), SMB_DATA (bidir, see VISION_BETA_EBB[5B], NVME[6B]), SMB_nALERT (in, see VISION_BETA_EBB[5B], NVME[6B]), SPI1_MISO (in, see VISION_BETA_EBB[5A]), SPI1_MOSI (out, see VISION_BETA_EBB[5A]), SPI1_nCS_0 (out, see VISION_BETA_EBB[5A]), SPI1_nCS_1 (out, see VISION_BETA_EBB[5A]), SPI1_SCLK (out, see VISION_BETA_EBB[5A]), USB0_D_N (bidir, see VISION_BETA_EBB[5D], RECOVERY_USBC[1A]), USB0_D_P (bidir, see VISION_BETA_EBB[5D], RECOVERY_USBC[1A]), USB1_D_N (bidir, see VISION_BETA_EBB[5D]), USB1_D_P (bidir, see VISION_BETA_EBB[5D]), USBSS0_RX_N (out, see VISION_BETA_EBB[5D]), USBSS0_RX_P (out, see VISION_BETA_EBB[5D]), USBSS0_TX_N (in, see VISION_BETA_EBB[5D]), USBSS0_TX_P (in, see VISION_BETA_EBB[5D]), VBUS_DETECT (in, see VISION_BETA_EBB[5D], RECOVERY_USBC[1A])

### Nets
2V_AUX: C214.2 U24.3(VIN)
3V3_AUX: R174.2 R235.2 R266.2 R269.2 R272.2 R275.2
5V_MAIN: J1.251 J1.252 J1.253 J1.254 J1.255 J1.256 J1.257 J1.258 J1.259 J1.260 R63.2 R118.2
GND: C103.2 C116.2 C213.2 C214.1 D1.3(GND) D1.8(GND) D2.3(GND) D2.8(GND) D3.3(GND) D3.8(GND) D4.3(GND) D4.8(GND) D5.3(GND) D5.8(GND) D6.3(GND) D6.8(GND) D7.3(GND) D7.8(GND) D8.3(GND) D8.8(GND) D9.3(GND) D9.8(GND) D10.3(GND) D10.8(GND) D11.3(GND) D11.8(GND) D12.3(GND) D12.8(GND) D13.3(GND) D13.8(GND) D14.3(GND) D14.8(GND) D15.3(GND) D15.8(GND) D16.3(GND) D16.8(GND) D17.3(GND) D17.8(GND) D18.3(GND) D18.8(GND) D19.3(GND) D19.8(GND) D20.3(GND) D20.8(GND) D21.3(GND) D21.8(GND) J1.1 J1.2 J1.7 J1.8 J1.13 J1.14 J1.19 J1.20 J1.25 J1.26 J1.31 J1.32 J1.37 J1.38 J1.43 J1.44 J1.49 J1.50 J1.55 J1.56 J1.61 J1.62 J1.67 J1.68 J1.73 J1.74 J1.79 J1.80 J1.85 J1.86 J1.102 J1.107 J1.113 J1.119 J1.125 J1.129 J1.132 J1.135 J1.138 J1.141 J1.144 J1.146 J1.147 J1.152 J1.153 J1.158 J1.159 J1.164 J1.165 J1.170 J1.171 J1.176 J1.177 J1.200 J1.201 J1.231 J1.241 J1.242 J1.243 J1.244 J1.245 J1.246 J1.247 J1.248 J1.249 J1.250 J1.261(MNT_1) J1.262(MNT_2) J17.2 MP1.1 MP2.1 Q9.1(Source1) Q9.4(Source2) R127.2 R172.1 R173.1 R316.1 U11.3(GND) U12.3(GND) U24.1(GND)
JETSON_1V8_REF: C103.1 C116.1 C213.1 Q7.1(G) Q8.1(G) Q18.1(G) Q19.1(G) Q20.1(G) Q21.1(G) Q22.1(G) R62.2 R92.2 R175.2 R176.2 R234.2 R265.2 R268.2 R271.2 R274.2 R355.2 U11.5(VCC) U12.5(VCC) U24.2(VOUT) U24.4(VOUT)
1V8_CAM0_PWDN: J1.114 R128.1
1V8_CAM1_PWDN: J1.120 R129.1
1V8_SMB_nALERT: R176.1 U12.2(A) ; port SMB_nALERT
1V8_SPI1_MISO: D3.4(IO3) D3.7(NC) J1.108 Q20.2(S) R268.1
1V8_SPI1_MOSI: D3.1(IO1) D3.10(NC) J1.104 Q18.2(S) R234.1
1V8_SPI1_nCS_0: D3.5(IO4) D3.6(NC) J1.110 Q21.2(S) R271.1
1V8_SPI1_nCS_1: J1.112 Q22.2(S) R274.1
1V8_SPI1_SCLK: D3.2(IO2) D3.9(NC) J1.106 Q19.2(S) R265.1
CAM0_PWDN: Q9.6(Drain1) ; port CAM0_PWDN
CAM1_PWDN: Q9.3(Drain2) ; port CAM1_PWDN
CAM_I2C_SCL: D18.4(IO3) D18.7(NC) J1.213 ; port CAM_I2C_SCL
CAM_I2C_SDA: D18.5(IO4) D18.6(NC) J1.215 ; port CAM_I2C_SDA
CAN_RX: D17.1(IO1) D17.10(NC) J1.143 ; port CAN_RX
CAN_TX: D17.2(IO2) D17.9(NC) J1.145 ; port CAN_TX
CSI0_CLK_N: D6.2(IO2) D6.9(NC) J1.10 ; port CSI0_CLK_N
CSI0_CLK_P: D6.1(IO1) D6.10(NC) J1.12 ; port CSI0_CLK_P
CSI0_D0_N: D6.5(IO4) D6.6(NC) J1.4 ; port CSI0_D0_N
CSI0_D0_P: D6.4(IO3) D6.7(NC) J1.6 ; port CSI0_D0_P
CSI0_D1_N: R3.2 ; port CSI0_D1_N
CSI0_D1_P: R4.2 ; port CSI0_D1_P
CSI1_D0_N: R5.2 ; port CSI1_D0_N
CSI1_D0_P: R6.2 ; port CSI1_D0_P
CSI1_D1_N: D7.4(IO3) D7.7(NC) J1.15 ; port CSI1_D1_N
CSI1_D1_P: D7.5(IO4) D7.6(NC) J1.17 ; port CSI1_D1_P
CSI2_CLK_N: D19.1(IO1) D19.10(NC) J1.28 ; port CSI2_CLK_N
CSI2_CLK_P: D19.2(IO2) D19.9(NC) J1.30 ; port CSI2_CLK_P
CSI2_D0_N: D13.4(IO3) D13.7(NC) J1.22 ; port CSI2_D0_N
CSI2_D0_P: D13.5(IO4) D13.6(NC) J1.24 ; port CSI2_D0_P
CSI2_D1_N: D19.4(IO3) D19.7(NC) J1.34 ; port CSI2_D1_N
CSI2_D1_P: D19.5(IO4) D19.6(NC) J1.36 ; port CSI2_D1_P
CSI3_D0_N: D14.1(IO1) D14.10(NC) J1.21 ; port CSI3_D0_N
CSI3_D0_P: D14.2(IO2) D14.9(NC) J1.23 ; port CSI3_D0_P
CSI3_D1_N: D14.4(IO3) D14.7(NC) J1.33 ; port CSI3_D1_N
CSI3_D1_P: D14.5(IO4) D14.6(NC) J1.35 ; port CSI3_D1_P
DEBUG_RXD: R64.2 ; port DEBUG_RXD
DEBUG_TXD: R122.2 ; port DEBUG_TXD
DP1_AUX_N: D20.4(IO3) D20.7(NC) J1.98 ; port DP1_AUX_N
DP1_AUX_P: D20.5(IO4) D20.6(NC) J1.100 ; port DP1_AUX_P
DP1_HPD: D20.2(IO2) D20.9(NC) J1.96 ; port DP1_HPD
DP1_TXD0_N: D8.1(IO1) D8.10(NC) J1.63 ; port DP1_TXD0_N
DP1_TXD0_P: D8.2(IO2) D8.9(NC) J1.65 ; port DP1_TXD0_P
DP1_TXD1_N: D8.4(IO3) D8.7(NC) J1.69 ; port DP1_TXD1_N
DP1_TXD1_P: D8.5(IO4) D8.6(NC) J1.71 ; port DP1_TXD1_P
DP1_TXD2_N: D15.1(IO1) D15.10(NC) J1.75 ; port DP1_TXD2_N
DP1_TXD2_P: D15.2(IO2) D15.9(NC) J1.77 ; port DP1_TXD2_P
DP1_TXD3_N: D15.4(IO3) D15.7(NC) J1.81 ; port DP1_TXD3_N
DP1_TXD3_P: D15.5(IO4) D15.6(NC) J1.83 ; port DP1_TXD3_P
DP_HDMI_CEC: D20.1(IO1) D20.10(NC) J1.94 ; port DP_HDMI_CEC
GBE_LED_ACT: J1.194 ; port GBE_LED_ACT
GBE_LED_LINK: J1.188 ; port GBE_LED_LINK
GBE_MDI0_N: D5.1(IO1) D5.10(NC) J1.184 ; port GBE_MDI0_N
GBE_MDI0_P: D5.2(IO2) D5.9(NC) J1.186 ; port GBE_MDI0_P
GBE_MDI1_N: D5.4(IO3) D5.7(NC) J1.190 ; port GBE_MD1_N
GBE_MDI1_P: D5.5(IO4) D5.6(NC) J1.192 ; port GBE_MD1_P
GBE_MDI2_N: D12.1(IO1) D12.10(NC) J1.196 ; port GBE_MDI2_N
GBE_MDI2_P: D12.2(IO2) D12.9(NC) J1.198 ; port GBE_MDI2_P
GBE_MDI3_N: D12.4(IO3) D12.7(NC) J1.202 ; port GBE_MDI3_N
GBE_MDI3_P: D12.5(IO4) D12.6(NC) J1.204 ; port GBE_MDI3_P
GPIO08_FAN_TACH: J1.208 ; port GPIO08_FAN_TACH
GPIO10_nSMB_ALERT: J1.212 R175.1 U12.4(Y)
GPIO14_FAN_PWM: J1.230 ; port GPIO14_FAN_CTRL
GPIO_01: J1.118
GPIO_02: J1.124
GPIO_03: J1.126
GPIO_04: J1.127
GPIO_05: J1.128
GPIO_06: J1.130
GPIO_07: J1.206
GPIO_09: J1.211
GPIO_11: J1.216
GPIO_12: J1.218
GPIO_13: J1.228
I2C0_SCL: D2.4(IO3) D2.7(NC) J1.185 ; port I2C0_SCL
I2C0_SDA: D2.5(IO4) D2.6(NC) J1.187 ; port I2C0_SDA
I2C1_SCL: J1.189 ; port SMB_CLK
I2C1_SDA: J1.191 ; port SMB_DATA
I2S0_DIN: D4.2(IO2) D4.9(NC) J1.195 TP17.1(TP)
I2S0_DOUT: D4.1(IO1) D4.10(NC) J1.193 TP21.1(TP) ; port I2S0_DOUT
I2S0_FS: D4.4(IO3) D4.7(NC) J1.197 TP88.1(TP) ; port I2S0_FS
I2S0_SCLK: D4.5(IO4) D4.6(NC) J1.199 TP89.1(TP) ; port I2S0_SCLK
MODULE_ID: J1.217 R127.1
nFORCE_RECOVERY: J1.214 J17.1 R355.1 ; port nFORCE_RECOVERY
nMOD_SLEEP: J1.178 ; port nMOD_SLEEP
nSHUTDOWN_REQ: J1.233 ; port nSHUTDOWN_REQ
nSYS_RESET: J1.239 ; port nSYS_RESET
PCIE0_CLK_N: D1.1(IO1) D1.10(NC) J1.160 ; port PCIE0_CLK_N
PCIE0_CLK_P: D1.2(IO2) D1.9(NC) J1.162 ; port PCIE0_CLK_P
PCIE0_nCLKREQ: J1.180 ; port PCIE0_nCLKREQ
PCIE0_nRST: D2.2(IO2) D2.9(NC) J1.181 ; port PCIE0_nRST
PCIE0_RX0_N: D10.1(IO1) D10.10(NC) J1.131 ; port PCIE0_RX0_N
PCIE0_RX0_P: D10.2(IO2) D10.9(NC) J1.133 ; port PCIE0_RX0_P
PCIE0_RX1_N: D10.4(IO3) D10.7(NC) J1.137 ; port PCIE0_RX1_N
PCIE0_RX1_P: D10.5(IO4) D10.6(NC) J1.139 ; port PCIE0_RX1_P
PCIE0_RX2_N: D17.4(IO3) D17.7(NC) J1.149 ; port PCIE0_RX2_N
PCIE0_RX2_P: D17.5(IO4) D17.6(NC) J1.151 ; port PCIE0_RX2_P
PCIE0_RX3_N: D16.1(IO1) D16.10(NC) J1.155 ; port PCIE0_RX3_N
PCIE0_RX3_P: D16.2(IO2) D16.9(NC) J1.157 ; port PCIE0_RX3_P
PCIE0_TX0_N: D21.1(IO1) D21.10(NC) J1.134 ; port PCIE0_TX0_N
PCIE0_TX0_P: D21.2(IO2) D21.9(NC) J1.136 ; port PCIE0_TX0_P
PCIE0_TX1_N: D21.4(IO3) D21.7(NC) J1.140 ; port PCIE0_TX1_N
PCIE0_TX1_P: D21.5(IO4) D21.6(NC) J1.142 ; port PCIE0_TX1_P
PCIE0_TX2_N: D11.1(IO1) D11.10(NC) J1.148 ; port PCIE0_TX2_N
PCIE0_TX2_P: D11.2(IO2) D11.9(NC) J1.150 ; port PCIE0_TX2_P
PCIE0_TX3_N: D11.4(IO3) D11.7(NC) J1.154 ; port PCIE0_TX3_N
PCIE0_TX3_P: D11.5(IO4) D11.6(NC) J1.156 ; port PCIE0_TX3_P
PCIE_32K_CLK: R174.1 U11.4(Y) ; port PCIE_32K_CLK
PCIE_WAKE: D2.1(IO1) D2.10(NC) J1.179 ; port PCIE_WAKE
PMIC_BBAT: J1.235 TP18.1(TP)
POWER_EN: J1.237 ; port POWER_EN
PRE_CSI0_D1_N: D13.1(IO1) D13.10(NC) J1.16 R3.1
PRE_CSI0_D1_P: D13.2(IO2) D13.9(NC) J1.18 R4.1
PRE_CSI1_D0_N: D7.1(IO1) D7.10(NC) J1.3 R5.1
PRE_CSI1_D0_P: D7.2(IO2) D7.9(NC) J1.5 R6.1
PRE_PCIE_32K_CLK: J1.210 U11.2(A)
SLEEP/nWAKE: J1.240 R316.2 ; port SLEEP/nWAKE
UART2_RXD: J1.238 Q7.2(S) R62.1
UART2_TXD: J1.236 Q8.2(S) R92.1
USB0_D_N: D9.1(IO1) D9.10(NC) J1.109 ; port USB0_D_N
USB0_D_P: D9.2(IO2) D9.9(NC) J1.111 ; port USB0_D_P
USB1_D_N: D9.4(IO3) D9.7(NC) J1.115 ; port USB1_D_N
USB1_D_P: D9.5(IO4) D9.6(NC) J1.117 ; port USB1_D_P
USBSS0_RX_N: D16.4(IO3) D16.7(NC) J1.161 ; port USBSS0_RX_N
USBSS0_RX_P: D16.5(IO4) D16.6(NC) J1.163 ; port USBSS0_RX_P
USBSS0_TX_N: D1.4(IO3) D1.7(NC) J1.166 ; port USBSS0_TX_N
USBSS0_TX_P: D1.5(IO4) D1.6(NC) J1.168 ; port USBSS0_TX_P
VBUS_DETECT: J1.87 ; port VBUS_DETECT
NetQ7_3: Q7.3(D) R63.1 R64.1
NetQ8_3: Q8.3(D) R118.1 R122.1
NetQ9_2: Q9.2(Gate1) R128.2 R172.2
NetQ9_5: Q9.5(Gate2) R129.2 R173.2
NetQ18_3: Q18.3(D) R235.1 R264.1
NetQ19_3: Q19.3(D) R266.1 R267.1
NetQ20_3: Q20.3(D) R269.1 R270.1
NetQ21_3: Q21.3(D) R272.1 R273.1
NetQ22_3: Q22.3(D) R275.1 R276.1
NetR264_2: R264.2 ; port SPI1_MOSI
NetR267_2: R267.2 ; port SPI1_SCLK
NetR270_2: R270.2 ; port SPI1_MISO
NetR273_2: R273.2 ; port SPI1_nCS_0
NetR276_2: R276.2 ; port SPI1_nCS_1

Not connected (* = marked no-connect by the designer): D18 1(IO1) 2(IO2) 9(NC) 10(NC); J1 9* 11* 27* 29* 39* 40* 41* 42* 45* 46* 47* 48* 51* 52* 53* 54* 57* 58* 59* 60* 64* 66* 70* 72* 76* 78* 82* 84* 88* 89* 90* 91* 92* 93* 95* 97* 99* 101* 103* 105* 116* 121* 122* 123* 167* 169* 172* 173* 174* 175* 182* 183* 203* 205* 207* 209* 219* 220* 221* 222* 223* 224* 225* 226* 227* 229* 232* 234*; U11 1(NC)*; U12 1(NC)*

### Layout directives
net class 85DIFF: PCIE0_CLK_N, PCIE0_CLK_P, PCIE0_RX0_N, PCIE0_RX0_P, PCIE0_RX1_N, PCIE0_RX1_P, PCIE0_RX2_N, PCIE0_RX2_P, PCIE0_RX3_N, PCIE0_RX3_P, PCIE0_TX0_N, PCIE0_TX0_P, PCIE0_TX1_N, PCIE0_TX1_P, PCIE0_TX2_N, PCIE0_TX2_P, PCIE0_TX3_N, PCIE0_TX3_P, USBSS0_RX_N, USBSS0_RX_P, USBSS0_TX_N, USBSS0_TX_P
net class 90DIFF: USB0_D_N, USB0_D_P, USB1_D_N, USB1_D_P
differential pair; differential pair class 85DIFF: PCIE0_CLK_N, PCIE0_CLK_P, PCIE0_RX0_N, PCIE0_RX0_P, PCIE0_RX1_N, PCIE0_RX1_P, PCIE0_RX2_N, PCIE0_RX2_P, PCIE0_RX3_N, PCIE0_RX3_P, PCIE0_TX0_N, PCIE0_TX0_P, PCIE0_TX1_N, PCIE0_TX1_P, PCIE0_TX2_N, PCIE0_TX2_P, PCIE0_TX3_N, PCIE0_TX3_P, USBSS0_RX_N, USBSS0_RX_P, USBSS0_TX_N, USBSS0_TX_P
differential pair; differential pair class 90DIFF: USB0_D_N, USB0_D_P, USB1_D_N, USB1_D_P
net class 100DIFF: CSI0_CLK_N, CSI0_CLK_P, CSI0_D0_N, CSI0_D0_P, CSI0_D1_N, CSI0_D1_P, CSI1_D0_N, CSI1_D0_P, CSI1_D1_N, CSI1_D1_P, CSI2_CLK_N, CSI2_CLK_P, CSI2_D0_N, CSI2_D0_P, CSI2_D1_N, CSI2_D1_P, CSI3_D0_N, CSI3_D0_P, CSI3_D1_N, CSI3_D1_P, DP1_TXD0_N, DP1_TXD0_P, DP1_TXD1_N, DP1_TXD1_P, DP1_TXD2_N, DP1_TXD2_P, DP1_TXD3_N, DP1_TXD3_P, GBE_MDI0_N, GBE_MDI0_P, GBE_MDI1_N, GBE_MDI1_P, GBE_MDI2_N, GBE_MDI2_P, GBE_MDI3_N, GBE_MDI3_P, PRE_CSI0_D1_N, PRE_CSI0_D1_P, PRE_CSI1_D0_N, PRE_CSI1_D0_P
differential pair; differential pair class 100DIFF: DP1_TXD0_N, DP1_TXD0_P, DP1_TXD1_N, DP1_TXD1_P, DP1_TXD2_N, DP1_TXD2_P, DP1_TXD3_N, DP1_TXD3_P, GBE_MDI0_N, GBE_MDI0_P, GBE_MDI1_N, GBE_MDI1_P, GBE_MDI2_N, GBE_MDI2_P, GBE_MDI3_N, GBE_MDI3_P, PRE_CSI0_D1_N, PRE_CSI0_D1_P, PRE_CSI1_D0_N, PRE_CSI1_D0_P
differential pair: DP1_AUX_N, DP1_AUX_P

### Notes on the sheet
- SODIMM CONNECTOR
- DEBUG USB + UART
- FIGURE 10-1 OF ORIN SERIES DESIGN GUIDE, POLARITY OF SOME CSI LANES IS SWAPPED ON SoC
- JUMPERS ON USBSS0 IN CASE WE WANT CAPS
- USB3_0
- ETH_0
- (near Q7) GATE V_TH OK
- SPI0
- UART0
- USB2_1
- (near Q8) GATE V_TH OK
- CAM0_MCLK
- CAM1_MCLK
- USB2_2
- UART1
- CSI_0-3
- (near R3) JUMPERS HERE SINCE POLARITY SWAPPED ON ORIN
- ESD PROTECTED PINS
- (near R127) MODULE_ID
- - I2C2 IS 1.8V DO NOT USE
  - POWER ON SEQUENCE IS IN SECTION 3 OF DATASHEET --> CARRIER BOARD MANAGES POWER, NOT JETSON
  - SPI IS 1V8 CMOS LOGIC
- SDMMC1
- I2S1
- (near MP1) Standoffs
- I2C2
- UART2 --> DEBUG
- nSYS_RESET indicates when carrier can power on
- PCIE_0 (4x)
- ESD PROTECTION
- (near U11) 32K_CLK_BUFF
- ETH ESD
- CSI ESD
- HDMI ESD
- USB ESD
- PCIE SUSPEND CLOCK BUFFER
- (near U12) SMB_nALERT BUFF
- PORT CHECKLIST
- BUFFER FOR SMB_ALERT BASED ON ORIN
- CAM I2C ESD
- NO JUMP HERE SINCE JUMP IN NVME SCHEM
- HDMI
- I2C_0-1
- PCIe and USBSS ESD
- SPI ESD
- MISC ESD
- CAN
- GPIO
- (near R316) PULLED DOWN SINCE ACTIVE LOW TO WAKE MODULE
  WON'T USE SLEEP/nWAKE BUT CONNECT TO STM AND EXPOSE
- POWER
- I2S_0
- LOOK INTO PUTTING JETSON TO SLEEP FOR SENTRY MODE ETC.
- (near Q18) GATE V_TH OK
- 1V8 REF LDO
- (near Q19) GATE V_TH OK
- SPI_1
- (near Q20) GATE V_TH OK
- (near U24) https://developer.download.nvidia.com/assets/embedded/secure/jetson/orin_nx/docs/Jetson-Orin-NX-Series-Modules-Data-Sheet_DS-10712-001_v1.1.pdf?qhjqqJOfVnHCM-1XF3yIQpd2xfOOHwmcgVwMEoYJ7MxLV6htvBcCQBAWi_BDO8yBEWslRcUaReucjDkH91McAghWwJmYjhTJoVoEUvLFgX583-qKr_REPRGUalLshQ-DeOK5XvySH5OmW4RDnQayRqIhzIBBSUWPjFaWLdJjM1JhWiyI3hM5VtWcQCIuw7hGP4sJ7ZLCMgQXeMz6eFhUxr5xiOQPPyQ1&t=eyJscyI6ImdzZW8iLCJsc2QiOiJodHRwczovL3d3dy5nb29nbGUuY29tLyJ9
- https://developer.download.nvidia.com/assets/embedded/secure/jetson/orin_nano/docs/Jetson-Orin-Nano-Series-Modules-Data-Sheet_DS-11105-001_v1.2.pdf?jdQi_j839Sjggjj5QTF3_oOgnPN2J2ewz7Km2q-aLyRAS0YMswcsS8demvG6kdssXTo3By--j94fp-O5W54ShkpP0OL6Z16cXsATsCs5kVxLQzyDWp4PJJSuB9S5pyMOEFmtw_tlPL_Gy2oPuhK_UbNdkrgh1dCA55zEuK928asFQhAHapZ0s__KiE7erU3EBWJIZ94vBC5BwytStbskK9hDtogPdFhuGCQNTg==&t=eyJscyI6ImdzZW8iLCJsc2QiOiJodHRwczovL3d3dy5nb29nbGUuY29tLyJ9
- https://resources.altium.com/p/gigabit-ethernet-101-basics-implementation
- LDO SHOULD BE OFF UNTIL JETSON BOOTS
- (near Q21) GATE V_TH OK
- Is there any reason ever to not use nmos level shifters?
  Current LDOs have 1V drop so my 2V_AUX reg needs to have a higher voltage. Do you know any dropin replacements that don't break the bank and have less drop? Currently have LD1117
- https://www.congatec.com/fileadmin/user_upload/Documents/Application_Notes/AN43_M.2_Pinout_Descriptions_and_Reference_Designs.pdf
- Jetson reference manual
- https://developer.download.nvidia.com/assets/embedded/secure/jetson/orin_nx/docs/DG-10931-001_v1.2.pdf?a9ej-2Bw8ItDc1cnJp_Orjmj0ruhafQwJG7pHYeyXv2gwzFspQ0ZbPaHE0IwtPv6h2NAYJaZXDoFolUZ5Iw8vU13fA-kLmHK94KlPsyvaeFIbWePzp1X10HDT7HvJCgNl1WkV_8WJp9-smZyxlSW_wKeuMdy5xgzu_0wxoi4gg==&t=eyJscyI6ImdzZW8iLCJsc2QiOiJodHRwczovL3d3dy5nb29nbGUuY29tLyJ9
- (near Q22) GATE V_TH OK

### Library data of the parts
C103 C116 = CMP-001-00058-1: LARGE PADS, 0402 CAP, CHANGE COMMENT TO MATCH REAL P/N; Capacitor Type: Ceramic; Min Operating Temperature: -55°C; Mounting Technology: Surface Mount; Pins: 2; Case/Package: 0402; RoHS Compliant: Yes; Max Operating Temperature: 85°C
C213 = CMP-2006-02792-2: Chip Multilayer Ceramic Capacitors for General Purpose, 0603, 10uF, X5R, 15%, 20%, 6.3V; Packaging: Tape and Reel; Voltage Rating (DC): 6.3V; Width: 0.031inch; Termination: SMD/SMT; Dielectric: X5R; Package Quantity: 4000; Voltage Rating: 6.3V; Capacitance: 10uF; Case/Package: 0603; Min Operating Temperature: -55°C; Voltage: 6.3V; Length: 1.6mm; Thickness: 0.035inch; Lead Free: Lead Free; Depth: 0.8mm; Case Code (Imperial): 0603; Max Operating Temperature: 85°C; Material: Ceramic; Height: 0.8mm; Tolerance: 20%; Mount: Surface Mount; REACH SVHC: No SVHC; Radiation Hardening: No; Case Code (Metric): 1608
C214 = CMP-2000-05393-2: Multilayer Ceramic Capacitors 100nF ±10% 50V X7R SMD 0402; Voltage: 50V; Dielectric Material: Ceramic; Min Operating Temperature: -55°C; Depth: 0.5mm; Radiation Hardening: No; RoHS Compliant: Yes; Voltage Rating (DC): 50V; Lead Free: Lead Free; Resistor Type: Ceramic; Height: 0.5mm; Dielectric: X7R; Thickness: 0.022inch; Case/Package: 0402; Case Code (Metric): 1005; Termination: SMD/SMT; Capacitance: 100nF; Packaging: Tape and Reel; Max Operating Temperature: 125°C; Mount: Surface Mount; Package Quantity: 1; Width: 0.02inch; Weight: 2.3E-05oz; Voltage Rating: 50V; Tolerance: 10%; Construction: Flat; Case Code (Imperial): 0402; Length: 1mm; REACH SVHC: No SVHC; Series: C
D1-D21 = CMP-04989-000002-1: 4-CHANNEL LOW-CAPACITANCE SURGE; Manufacturer: Texas Instruments; Value: 0.55pF; Reverse Standoff Voltage: 3.6V; Standoff Height: 0mm; Breakdown Voltage: 5.5V; Peak Pulse Current: 5.5A; Clamping Voltage: 11.5V; Direction: Bidirectional; Peak Pulse Power: 50W; Number Of Channels: 4; Ambient Temperature Range High: +125°C; ComponentLink2Description: Datasheet; Height: 0.55mm; Lead Free: Yes; Device Class L3: unset; Temperature Range High: +125°C; Temperature Range Low: -40°C; Package: DQA0010A; Temperature: -40°C to +125°C; Capacitance: 0.55pF; RoHS: TRUE; Mouser Description: 4-Channel Low-Capacitance Surge and ESD Protection Diode 10-USON -40 to 125; Category: Diode; Device Class L1: Circuit Protection; Octopart: https://octopart.com/esd204dqar-texas+instruments-89917476; Device Class L2: TVS Diodes; Ambient Temperature Range Low: -40°C; Manufacturer Part Number: ESD204DQAR; ComponentLink2URL: http://www.ti.com/lit/ds/symlink/esd204.pdf; Automotive: No; Digikey Description: 4-CHANNEL LOW-CAPACITANCE SURGE
J1 = CMP-03356-000001-1: DDR4 SODIMM 260P 9.2H STD; Manufacturer: TE Connectivity; Voltage Rating: 25V; Current Rating: 0.5A; Is Female: yes; Pitch: 0.5mm; Memory Type: SDRAM,DDR; Conn Orientation: Horizontal; Number Of Contacts: 260; Temperature: -55°C to +85°C; Octopart: https://octopart.com/2309413-1-te+connectivity-84799194; Device Class L3: unset; Contact Material: Gold,Nickel; ComponentLink2URL: https://www.te.com/commerce/DocumentDelivery/DDEController?Action=showdoc&DocId=Specification+Or+Standard%7F108-115122%7FA1%7Fpdf%7FEnglish%7FENG_SS_108-115122_A1.pdf%7F2309413-1; Manufacturer Part Number: 2309413-1; ComponentLink2Description: Datasheet; Digikey Description: DDR4 SODIMM 260P 9.2H STD; Height: 18.8mm; Footprint Url: https://www.te.com/commerce/DocumentDelivery/DDEController?Action=showdoc&DocId=Customer+Drawing%7F2309413%7F4%7Fpdf%7FEnglish%7FENG_CD_2309413_4.pdf%7F2309413-1; Temperature Range Low: -55°C; Device Class L2: Memory Connectors; Temperature Range High: +85°C; RoHS: TRUE; Automotive: No; Device Class L1: Connectors; Mouser Description: Conn DDR4 DIMM Socket SKT 260 POS 0.5mm Solder RA SMD T/R; Category: Conn; Package: 0; Lead Free: Yes
J17 = CMP-02766-001428-1: CONN HEADER VERT 2POS 2.54MM; Voltage Rating: 550V; Current Rating: 7.6A; Gender: Male; Number of Contacts: 2; Connector Type: Male Pin; Radiation Hardening: No; Orientation: Straight; Contact Plating: Gold; Max Operating Temperature: 125°C; Mount: Through Hole; Package Quantity: 1; Number of Rows: 1; Housing Material: Polyester; RoHS Compliant: Yes; Length: 5.08mm; Max Voltage Rating (AC): 550V; Pitch: 2.54mm; Packaging: Bulk; Depth: 2.54mm; Termination: Solder; Min Operating Temperature: -55°C; Housing Color: Black; Lead Free: Lead Free; Color: Black; Number of Positions: 2; Width: 2.54mm; Max Current Rating: 7.6A; REACH SVHC: No SVHC; Contact Material: Bronze; Contact Mating Length: 0.23inch; Series: TSW; Contact Type: Male Pin
MP1 MP2 = CMP-03913-59774857-1: 9774025243R Spacer Material: Steel, Tin-Plated Mounting: SMT Series: WA-SMST Thread D: M2; Outside Diameter: 4.3434mm; Threaded/Unthreaded: Threaded; Plating: Tin; REACH SVHC: Unknown; NexarPartId: 59774857; RoHS: Compliant; Material: Steel; Packaging: Tape and Reel; Max Operating Temperature: 150°C; Min Operating Temperature: -55°C; Length: 2.5mm; Height: 2.5mm
Q7 Q8 Q18-Q22 = CMP-2000-05968-1: N-Channel Enhancement Mode Mosfet, 50 V, 200 mA, -55 to 150 degC, 6-Pin SOT-323, RoHS, Tape and Reel; Typical Turn-Off Delay Time: 20ns; Number of Channels: 1Channel; Type: EnhancementModeFieldEffectTransistor; Brand: DiodesIncorporated; Vds - Drain-Source Breakdown Voltage: 75V; Vgs - Gate-Source Voltage: 20V; Rds On - Drain-Source Resistance: 1.4Ohms; Transistor Type: 1N-Channel; Configuration: Single; Unit Weight: 0.000212oz; Pd - Power Dissipation: 200mW; Id - Continuous Drain Current: 200mA; Forward Transconductance - Min: 0.1S; Manufacturer URL: http://www.diodes.com/; Series: BSS138; Package Description: 3-Pin Small Outline Transistor, Body 2 x 1.25 mm, Pitch 0.65 mm; Mounting Technology: SurfaceMount; Product Category: MOSFET; RoHS: True; Maximum Operating Temperature: +150C; Height: 1mm; Length: 2.2mm; Technology: Si; Width: 1.35mm; Datasheet URL: http://www.diodes.com/_files/datasheets/ds30206.pdf; Manufacturer: DiodesIncorporated; Package / Case: SOT-323-3; Typical Turn-On Delay Time: 20ns; Transistor Polarity: N-Channel; Factory Pack Quantity: 3000; Packaging: Reel; Product: MOSFETSmallSignal; Datasheet Version: Rev. 11-2, 09/2013; Package Reference: SOT323; Minimum Operating Temperature: -55C; Mounting Style: SMD/SMT; Channel Mode: Enhancement
Q9 = CMP-35916-000009-1: MOSFET 2N-CH 60V 0.3A; Input Capacitance: 40pF; Continuous Drain Current (ID): 300mA; Max Power Dissipation: 285mW; FET Type: 2 N-Channel; Rds On Max: 1.5R; Mount: Surface Mount; Drain to Source Voltage (Vdss): 60V; Packaging: Tape and Reel
R3-R6 R127 = CMP-009-00118-2: READ THE NAME; Pins: 2; Component Type: Standard; Design Item ID: CMP-009-00206-2; Source: 0402jump.SchLib
R62 R63 R92 R118 R174-R176 R234 R235 R265 R266 R268 R269 R271 R272 R274 R275 = CMP-1012-00623-3: Chip Resistor, 10 KOhm, +/- 1%, 0.1 W, -55 to 155 degC, 0603 (1608 Metric), RoHS, Tape and Reel; Manufacturer: Panasonic; Voltage Rating: 75V; Case\/Package: 0603; Power Rating: 100mW; Resistance: 10KOhm; Temperature Coefficient: 100ppm\/degreesC; Number of Pins: 2; Package Reference: 603; Depth: 0.8mm; Mount: SurfaceMount; Package Description: 2-Pin Surface Mount Device, Body 1.6 x 0.85 mm; Datasheet Version: 02/2017; Length: 1.6mm; Lead Free: LeadFree; Height: 0.45mm; Number of Terminations: 2; Max Power Dissipation: 100mW; Min Operating Temperature: -55degC; Datasheet URL: https://industrial.panasonic.com/cdbs/www-data/pdf/RDA0000/AOA0000C304.pdf; Termination: SMD/SMT; Case Code (Metric): 1608; Case Code (Imperial): 0603; Tolerance: 1%; Max Operating Temperature: 155degC; RoHSCompliant: true; Voltage Rating (DC): 75V; Radiation Hardening: No; Packaging: TapeandReel; Composition: ThickFilm; Mounting Technology: SurfaceMount; Manufacturer URL: http://www.panasonic.com/; Width: 0.031inch; REACH SVHC: NoSVHC; Contact Plating: Tin; Military Standard: Not; Package Quantity: 1
R64 R122 R128 R129 R264 R267 R270 R273 R276 = CMP-2000-00180-1: Manufacturer: Panasonic; Part Number: ERJ-3EKF1001V
R172 R173 R316 R355 = CMP-2000-00182-1: Manufacturer: Panasonic; Part Number: ERJ-3EKF1003V
TP17 TP18 TP21 TP88 TP89 = CMP-00025-2: Test Point .6mm
U11 U12 = CMP-0859-00290-4: IC BUFF/DVR NON-INVERT SC70-5; Number of Output Lines: 1; Turn-On Delay Time: 8.3ns; Min Supply Voltage: 1.65V; Polarity: Non-Inverting; Quiescent Current: 10uA; Low Level Output Current: 32mA; Nominal Supply Current: 40mA; Logic Function: Buffer; Max Supply Voltage: 5.5V; Number of Bits: 1; Number of Circuits: 1; Contact Plating: Gold; Max Operating Temperature: 125°C; Package Quantity: 1; Number of Channels: 1; Number of Outputs: 1; Case/Package: SC; Number of Gates: 1; Number of Pins: 5; Radiation Hardening: No; Min Operating Temperature: -40°C; Number of Bits per Element: 1; Lead Free: Lead Free; High Level Output Current: 32mA; Number of Input Lines: 1; Number of Inputs: 1; Propagation Delay: 8.3ns; Number of Elements: 1; Packaging: Tape and Reel; Mount: Surface Mount; Termination: SMD/SMT; REACH SVHC: No SVHC
U24 = CMP-0244-00308-1: Fixed Low Drop Positive Voltage Regulator, 1.8V, 4-Pin SOT-223, Tape and Reel; ComponentLink1URL: http://www.st.com; PackageReference: SOT-223; PackageDescription: 4-Pin SOT-223 Package, 6.5 x 3.5 mm Body, 2.3 mm Pitch, 7 mm Lead Span; ComponentLink2URL: http://www.st.com/internet/com/TECHNICAL_RESOURCES/TECHNICAL_LITERATURE/DATASHEET/CD00000544.pdf; ComponentLink2Description: Datasheet; ComponentLink1Description: Manufacturer URL; DatasheetVersion: 1/11/2011; PackageVersion: 2010

## Sheet NVME.SchDoc
size C; SheetNumber: 3; SheetTotal: 8
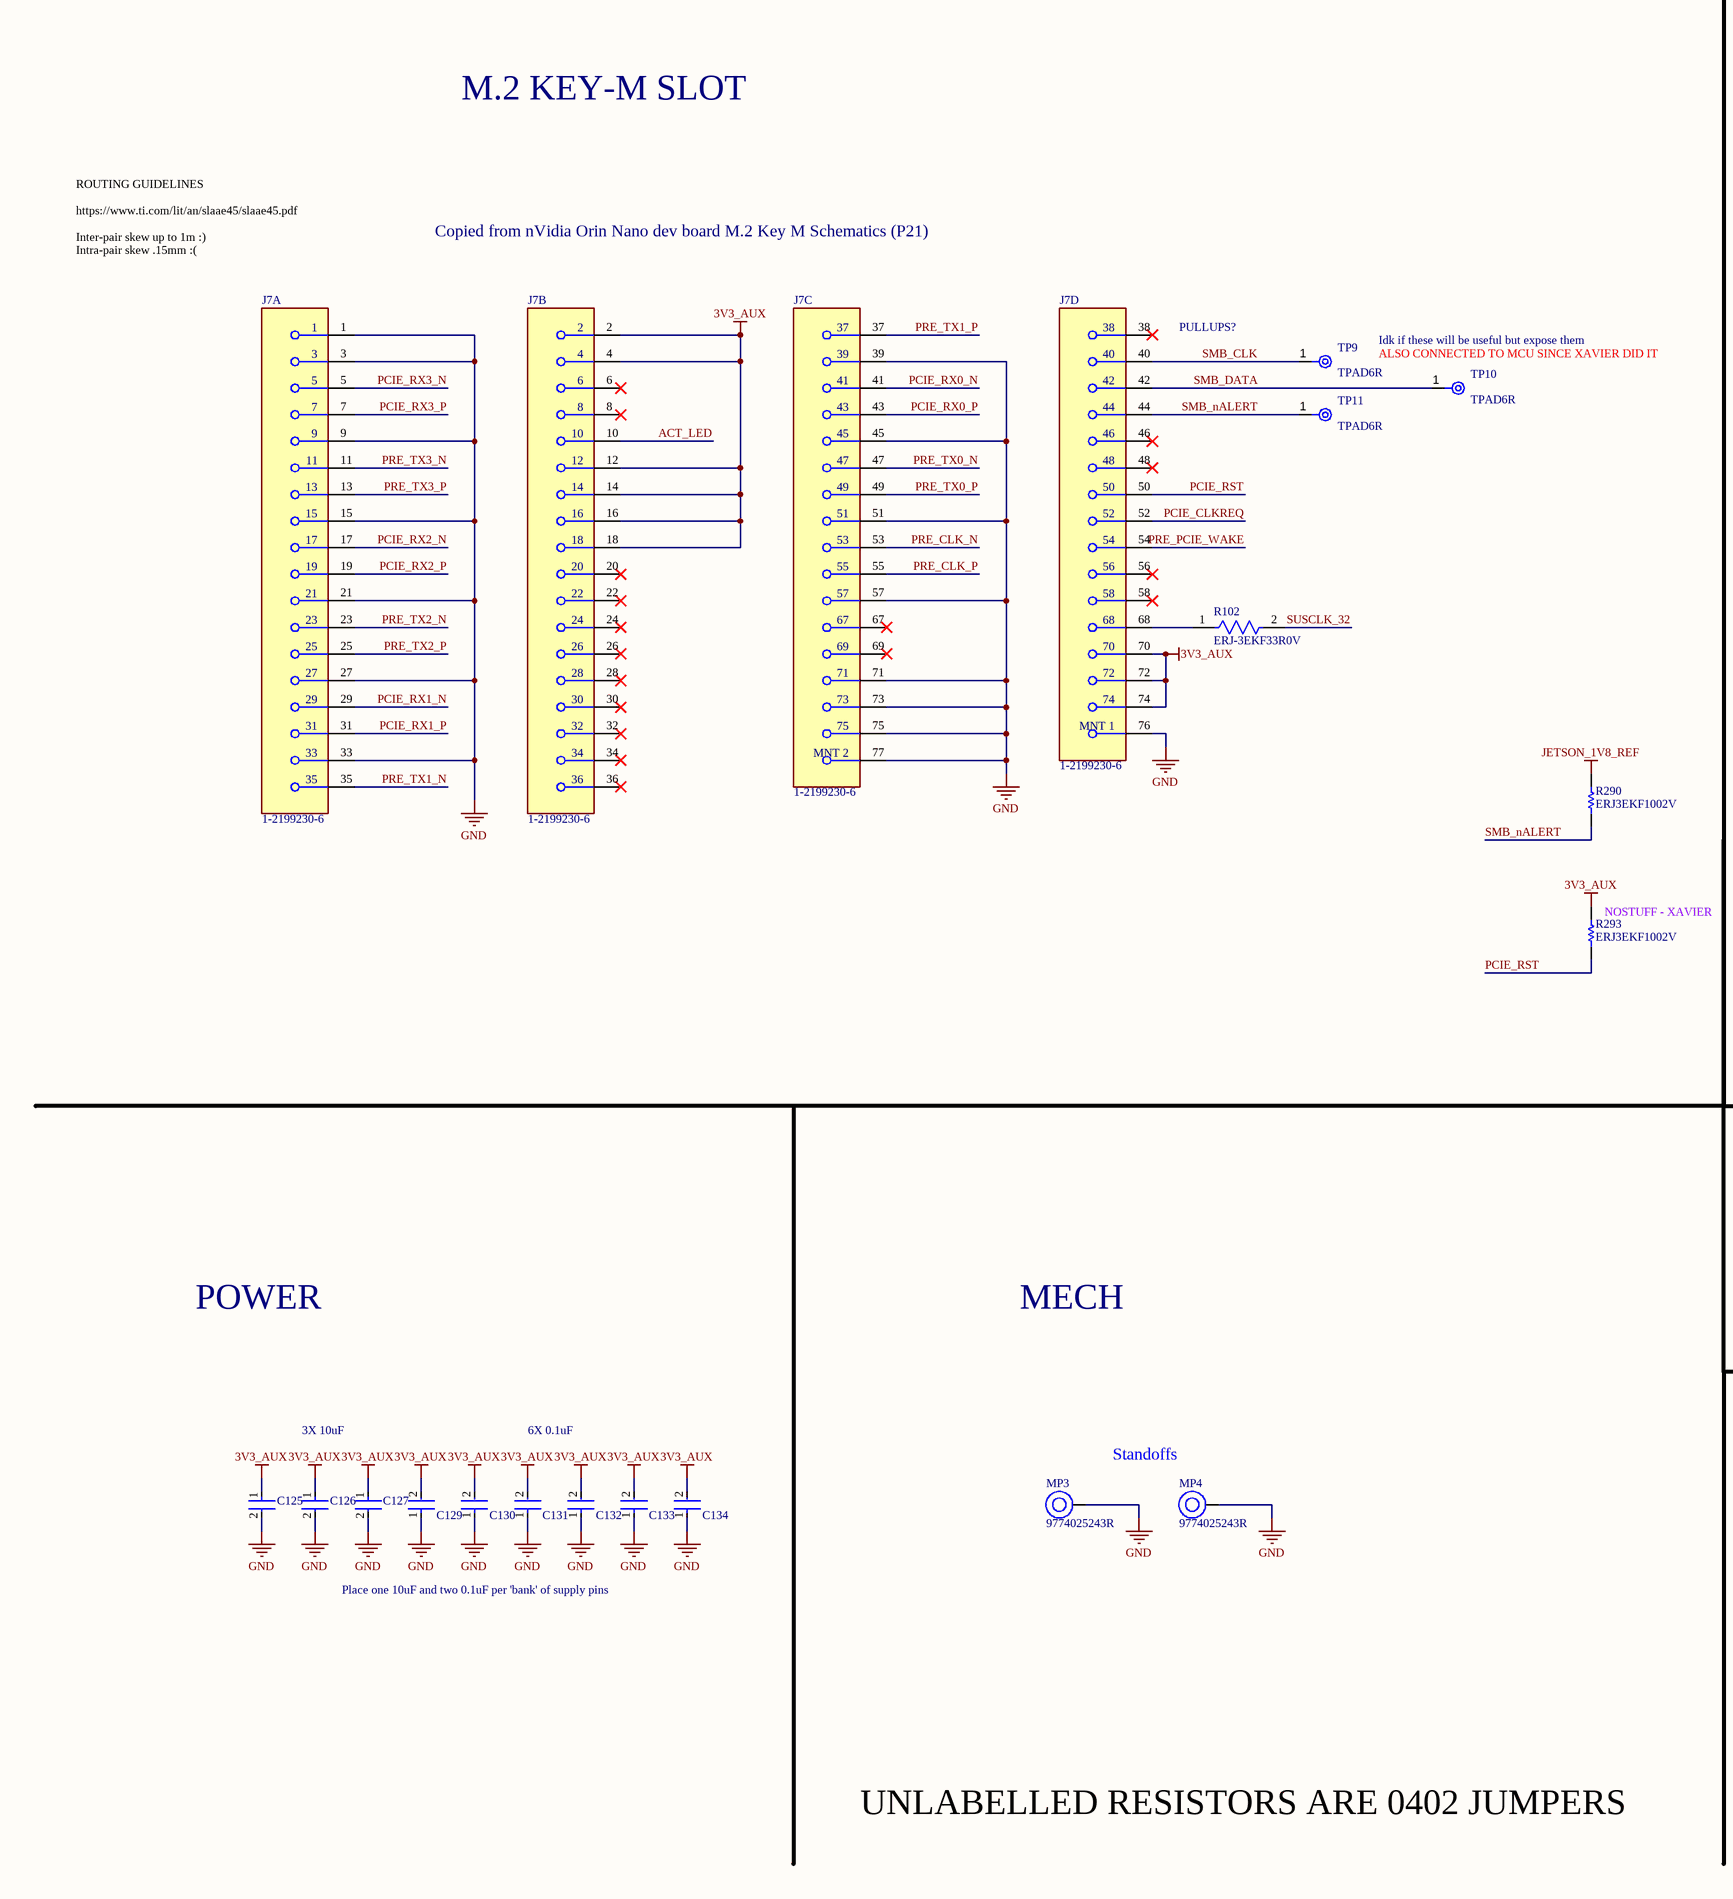
[diagram p9: NVME.SchDoc, left]
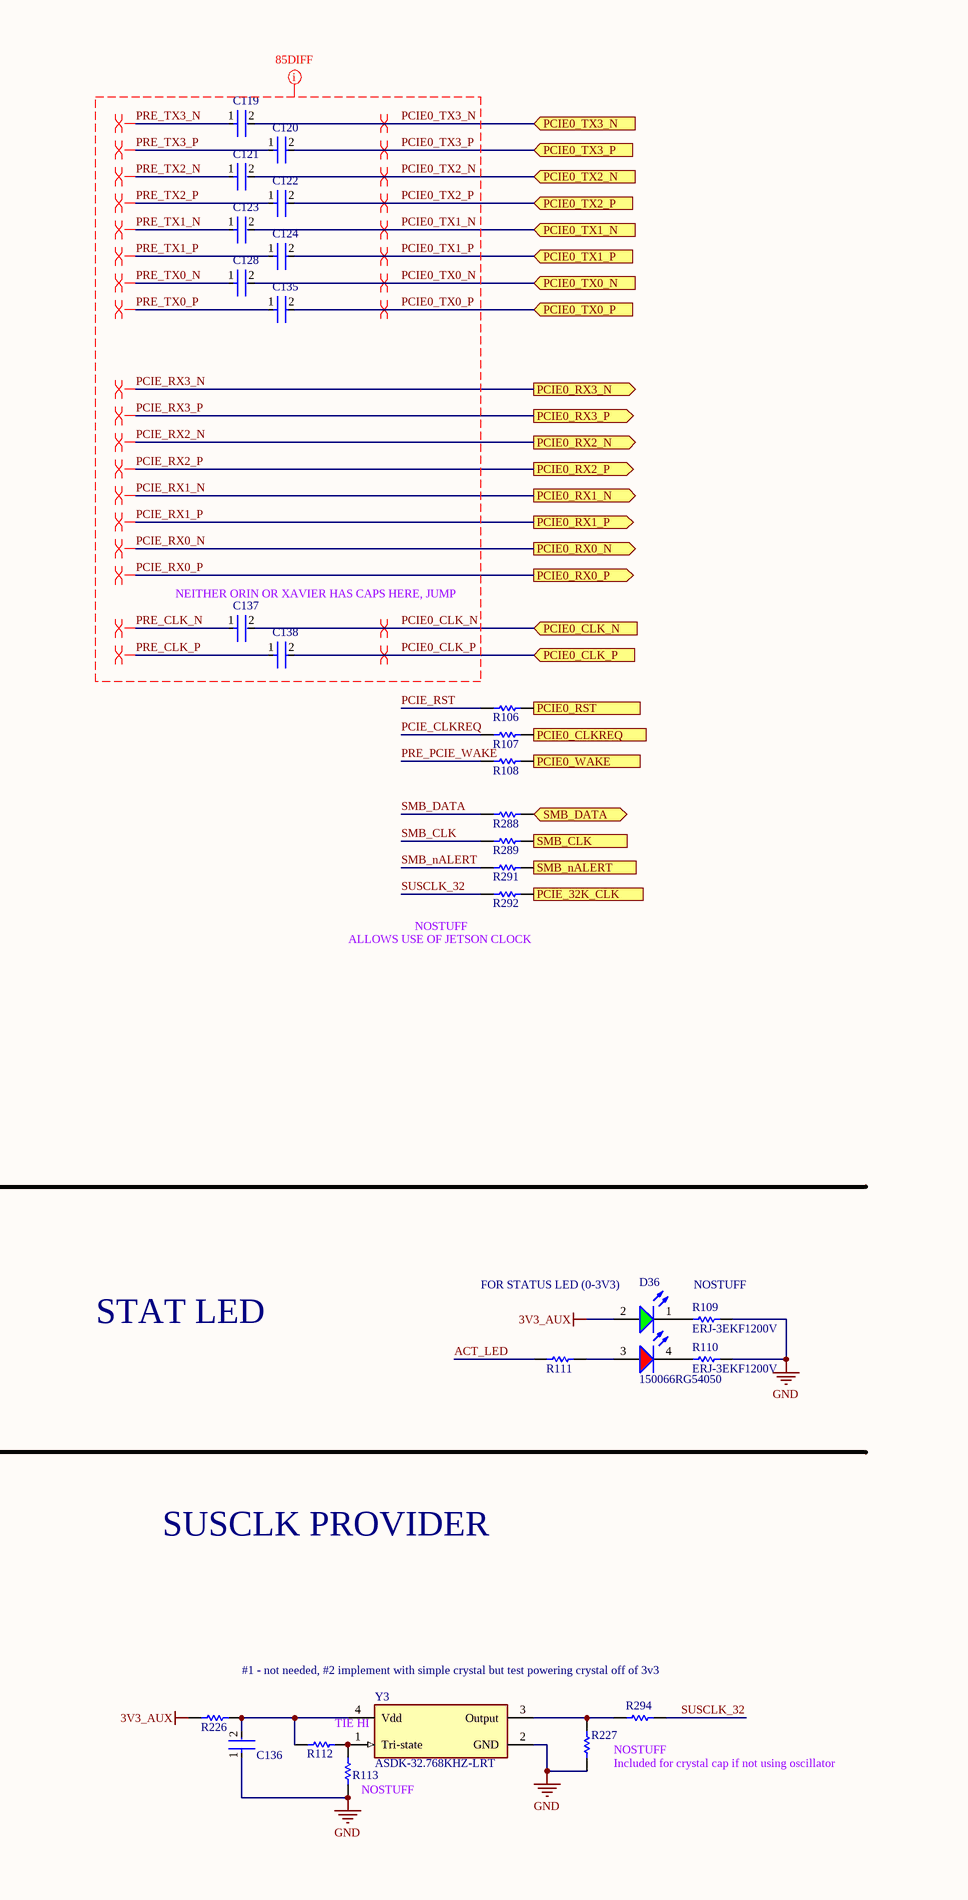
[diagram p10: NVME.SchDoc, right]

### Parts
C119  C1005X7R1A224K050BB  [FP-C1005-050-0_05-IPC_C]  (value not drawn)
C120  C1005X7R1A224K050BB  [FP-C1005-050-0_05-IPC_C]  (value not drawn)
C121  C1005X7R1A224K050BB  [FP-C1005-050-0_05-IPC_C]  (value not drawn)
C122  C1005X7R1A224K050BB  [FP-C1005-050-0_05-IPC_C]  (value not drawn)
C123  C1005X7R1A224K050BB  [FP-C1005-050-0_05-IPC_C]  (value not drawn)
C124  C1005X7R1A224K050BB  [FP-C1005-050-0_05-IPC_C]  (value not drawn)
C125  GRM188R60J106ME47D  [FP-GRM188-0_1-e0_2_0_55-IPC_A]  (value not drawn)
C126  GRM188R60J106ME47D  [FP-GRM188-0_1-e0_2_0_55-IPC_A]  (value not drawn)
C127  GRM188R60J106ME47D  [FP-GRM188-0_1-e0_2_0_55-IPC_A]  (value not drawn)
C128  C1005X7R1A224K050BB  [FP-C1005-050-0_05-IPC_C]  (value not drawn)
C129  C1005X7R1H104K050BB  [FP-C1005-050-0_05-IPC_C]  (value not drawn)
C130  C1005X7R1H104K050BB  [FP-C1005-050-0_05-IPC_C]  (value not drawn)
C131  C1005X7R1H104K050BB  [FP-C1005-050-0_05-IPC_C]  (value not drawn)
C132  C1005X7R1H104K050BB  [FP-C1005-050-0_05-IPC_C]  (value not drawn)
C133  C1005X7R1H104K050BB  [FP-C1005-050-0_05-IPC_C]  (value not drawn)
C134  C1005X7R1H104K050BB  [FP-C1005-050-0_05-IPC_C]  (value not drawn)
C135  C1005X7R1A224K050BB  [FP-C1005-050-0_05-IPC_C]  (value not drawn)
C136  C1005X7R1H104K050BB  [FP-C1005-050-0_05-IPC_C]  (value not drawn)
C137  C1005X7R1A224K050BB  [FP-C1005-050-0_05-IPC_C]  (value not drawn)
C138  C1005X7R1A224K050BB  [FP-C1005-050-0_05-IPC_C]  (value not drawn)
D36  150066RG54050  [WL-SBCD_0606]
J7  1-2199230-6  [FP-1-2199230-6-MFG]  (parts A,B,C,D of 4)
MP3  9774025243R  [9774025243]
MP4  9774025243R  [9774025243]
R102  ERJ-3EKF33R0V  [FP-ERJ3EK-MFG]
R106  0402 JUMPER  [RESC1005X40X25ML05T05]  (value not drawn)
R107  0402 JUMPER  [RESC1005X40X25ML05T05]  (value not drawn)
R108  0402 JUMPER  [RESC1005X40X25ML05T05]  (value not drawn)
R109  ERJ-3EKF1200V  [RESC1609X55X30ML15T15]
R110  ERJ-3EKF1200V  [RESC1609X55X30ML15T15]
R111  0402 JUMPER  [RESC1005X40X25ML05T05]  (value not drawn)
R112  0402 JUMPER  [RESC1005X40X25ML05T05]  (value not drawn)
R113  0402 JUMPER  [RESC1005X40X25ML05T05]  (value not drawn)
R226  0402 JUMPER  [RESC1005X40X25ML05T05]  (value not drawn)
R227  0402 JUMPER  [RESC1005X40X25ML05T05]  (value not drawn)
R288  0402 JUMPER  [RESC1005X40X25ML05T05]  (value not drawn)
R289  0402 JUMPER  [RESC1005X40X25ML05T05]  (value not drawn)
R290  ERJ3EKF1002V  [RESC1609X55X30LL15T15]
R291  0402 JUMPER  [RESC1005X40X25ML05T05]  (value not drawn)
R292  0402 JUMPER  [RESC1005X40X25ML05T05]  (value not drawn)
R293  ERJ3EKF1002V  [RESC1609X55X30LL15T15]
R294  0402 JUMPER  [RESC1005X40X25ML05T05]  (value not drawn)
TP9  TPAD6R  [New footprint 1]
TP10  TPAD6R  [New footprint 1]
TP11  TPAD6R  [New footprint 1]
Y3  ASDK-32.768KHZ-LRT  [FP-ASDK-MFG]

### Ports
PCIE0_CLK_N (in), PCIE0_CLK_P (in), PCIE0_CLKREQ (out), PCIE0_RST (in), PCIE0_RX0_N (out), PCIE0_RX0_P (out), PCIE0_RX1_N (out), PCIE0_RX1_P (out), PCIE0_RX2_N (out), PCIE0_RX2_P (out), PCIE0_RX3_N (out), PCIE0_RX3_P (out), PCIE0_TX0_N (in), PCIE0_TX0_P (in), PCIE0_TX1_N (in), PCIE0_TX1_P (in), PCIE0_TX2_N (in), PCIE0_TX2_P (in), PCIE0_TX3_N (in), PCIE0_TX3_P (in), PCIE0_WAKE (out), PCIE_32K_CLK (in), SMB_CLK (in), SMB_DATA (bidir), SMB_nALERT (out)

### Nets
3V3_AUX: C125.1 C126.1 C127.1 C129.2 C130.2 C131.2 C132.2 C133.2 C134.2 D36.2(A) J7.2 J7.4 J7.12 J7.14 J7.16 J7.18 J7.70 J7.72 J7.74 R226.1 R293.2
GND: C125.2 C126.2 C127.2 C129.1 C130.1 C131.1 C132.1 C133.1 C134.1 C136.1 J7.1 J7.3 J7.9 J7.15 J7.21 J7.27 J7.33 J7.39 J7.45 J7.51 J7.57 J7.71 J7.73 J7.75 J7.76(MNT_1) J7.77(MNT_2) MP3.1 MP4.1 R109.1 R110.1 R113.1 R227.1 Y3.2(GND)
JETSON_1V8_REF: R290.2
1V8_SMB_nALERT: R291.2 ; port SMB_nALERT
ACT_LED: J7.10 R111.1
I2C1_SCL: R289.2 ; port SMB_CLK
I2C1_SDA: R288.2 ; port SMB_DATA
PCIE0_CLK_N: C137.2 ; port PCIE0_CLK_N
PCIE0_CLK_P: C138.2 ; port PCIE0_CLK_P
PCIE0_TX0_N: C128.2 ; port PCIE0_TX0_N
PCIE0_TX0_P: C135.2 ; port PCIE0_TX0_P
PCIE0_TX1_N: C123.2 ; port PCIE0_TX1_N
PCIE0_TX1_P: C124.2 ; port PCIE0_TX1_P
PCIE0_TX2_N: C121.2 ; port PCIE0_TX2_N
PCIE0_TX2_P: C122.2 ; port PCIE0_TX2_P
PCIE0_TX3_N: C119.2 ; port PCIE0_TX3_N
PCIE0_TX3_P: C120.2 ; port PCIE0_TX3_P
PCIE_32K_CLK: R292.2 ; port PCIE_32K_CLK
PCIE_CLKREQ: J7.52 R107.1
PCIE_RST: J7.50 R106.1 R293.1
PCIE_RX0_N: J7.41 ; port PCIE0_RX0_N  [project net PCIE0_RX0_N]
PCIE_RX0_P: J7.43 ; port PCIE0_RX0_P  [project net PCIE0_RX0_P]
PCIE_RX1_N: J7.29 ; port PCIE0_RX1_N  [project net PCIE0_RX1_N]
PCIE_RX1_P: J7.31 ; port PCIE0_RX1_P  [project net PCIE0_RX1_P]
PCIE_RX2_N: J7.17 ; port PCIE0_RX2_N  [project net PCIE0_RX2_N]
PCIE_RX2_P: J7.19 ; port PCIE0_RX2_P  [project net PCIE0_RX2_P]
PCIE_RX3_N: J7.5 ; port PCIE0_RX3_N  [project net PCIE0_RX3_N]
PCIE_RX3_P: J7.7 ; port PCIE0_RX3_P  [project net PCIE0_RX3_P]
PRE_CLK_N: C137.1 J7.53
PRE_CLK_P: C138.1 J7.55
PRE_PCIE_WAKE: J7.54 R108.1
PRE_TX0_N: C128.1 J7.47
PRE_TX0_P: C135.1 J7.49
PRE_TX1_N: C123.1 J7.35
PRE_TX1_P: C124.1 J7.37
PRE_TX2_N: C121.1 J7.23
PRE_TX2_P: C122.1 J7.25
PRE_TX3_N: C119.1 J7.11
PRE_TX3_P: C120.1 J7.13
SMB_CLK: J7.40 R289.1 TP9.1(TP)
SMB_DATA: J7.42 R288.1 TP10.1(TP)
SMB_nALERT: J7.44 R290.1 R291.1 TP11.1(TP)
SUSCLK_32: R102.2 R292.1 R294.1
NetC136_2: C136.2 R112.1 R226.2 Y3.4(Vdd)
NetD36_1: D36.1(K) R109.2
NetD36_3: D36.3(A) R111.2
NetD36_4: D36.4(K) R110.2
NetJ7_68: J7.68 R102.1
NetR106_2: R106.2 ; port PCIE0_RST
NetR107_2: R107.2 ; port PCIE0_CLKREQ
NetR108_2: R108.2 ; port PCIE0_WAKE
NetR112_2: R112.2 R113.2 Y3.1(Tri-state)
NetR227_2: R227.2 R294.2 Y3.3(Output)

Not connected (* = marked no-connect by the designer): J7 6* 8* 20* 22* 24* 26* 28* 30* 32* 34* 36* 38* 46* 48* 56* 58* 67* 69*

### Layout directives
differential pair; differential pair class 85DIFF: PCIE0_CLK_N, PCIE0_CLK_P, PCIE0_RX0_N, PCIE0_RX0_P, PCIE0_RX1_N, PCIE0_RX1_P, PCIE0_RX2_N, PCIE0_RX2_P, PCIE0_RX3_N, PCIE0_RX3_P, PCIE0_TX0_N, PCIE0_TX0_P, PCIE0_TX1_N, PCIE0_TX1_P, PCIE0_TX2_N, PCIE0_TX2_P, PCIE0_TX3_N, PCIE0_TX3_P, PRE_CLK_N, PRE_CLK_P, PRE_TX0_N, PRE_TX0_P, PRE_TX1_N, PRE_TX1_P, PRE_TX2_N, PRE_TX2_P, PRE_TX3_N, PRE_TX3_P
net class 85DIFF: PCIE0_CLK_N, PCIE0_CLK_P, PCIE0_TX0_N, PCIE0_TX0_P, PCIE0_TX1_N, PCIE0_TX1_P, PCIE0_TX2_N, PCIE0_TX2_P, PCIE0_TX3_N, PCIE0_TX3_P, PCIE_RX0_N, PCIE_RX0_P, PCIE_RX1_N, PCIE_RX1_P, PCIE_RX2_N, PCIE_RX2_P, PCIE_RX3_N, PCIE_RX3_P, PRE_CLK_N, PRE_CLK_P, PRE_TX0_N, PRE_TX0_P, PRE_TX1_N, PRE_TX1_P, PRE_TX2_N, PRE_TX2_P, PRE_TX3_N, PRE_TX3_P

### Notes on the sheet
- M.2 KEY-M SLOT
- ROUTING GUIDELINES
  https://www.ti.com/lit/an/slaae45/slaae45.pdf
  Inter-pair skew up to 1m :)
  Intra-pair skew .15mm :(
- Copied from nVidia Orin Nano dev board M.2 Key M Schematics (P21)
- PULLUPS?
- (near TP10) Idk if these will be useful but expose them
- (near TP10) ALSO CONNECTED TO MCU SINCE XAVIER DID IT
- (near C137) NEITHER ORIN OR XAVIER HAS CAPS HERE, JUMP
- (near R292) ALLOWS USE OF JETSON CLOCK
- NOSTUFF
- (near R293) NOSTUFF - XAVIER
- STAT LED
- (near D36) FOR STATUS LED (0-3V3)
- (near R109) NOSTUFF
- POWER
- MECH
- 3X 10uF
- 6X 0.1uF
- Standoffs
- SUSCLK PROVIDER
- Place one 10uF and two 0.1uF per 'bank' of supply pins
- #1 - not needed, #2 implement with simple crystal but test powering crystal off of 3v3
- (near Y3) TIE HI
- (near R113) NOSTUFF
- Included for crystal cap if not using oscillator
- UNLABELLED RESISTORS ARE 0402 JUMPERS

### Library data of the parts
C119-C124 C128 C135 C137 C138 = CMP-08246-006072-1: Multilayer Ceramic Capacitors 220nF ±10% 10V X7R SMD 0402; Resistor Type: Ceramic; Dielectric: X7R; Voltage Rating (DC): 10V; Width: 0.02inch; Case Code (Metric): 1005; Mount: Surface Mount; Termination: SMD/SMT; Series: C; Tolerance: 10%; Depth: 0.5mm; Length: 1mm; Packaging: Tape and Reel; Radiation Hardening: No; Weight: 2.3E-05oz; Voltage Rating: 10V; Thickness: 0.022inch; Capacitance: 220nF; Case Code (Imperial): 0402; Lead Free: Lead Free; Case/Package: 0402; Package Quantity: 10000; Dielectric Material: Ceramic; RoHS Compliant: Yes; REACH SVHC: No SVHC; Min Operating Temperature: -55°C; Max Operating Temperature: 125°C; Height: 0.5mm; Construction: Flat
C125-C127 = CMP-2006-02792-2: as C213 on sheet JETSON; Packaging: Tape and Reel; Voltage Rating (DC): 6.3V; Width: 0.031inch; Termination: SMD/SMT; Dielectric: X5R; Package Quantity: 4000; Voltage Rating: 6.3V; Capacitance: 10uF; Case/Package: 0603; Min Operating Temperature: -55°C; Voltage: 6.3V; Length: 1.6mm; Thickness: 0.035inch; Lead Free: Lead Free; Depth: 0.8mm; Case Code (Imperial): 0603; Max Operating Temperature: 85°C; Material: Ceramic; Height: 0.8mm; Tolerance: 20%; Mount: Surface Mount; REACH SVHC: No SVHC; Radiation Hardening: No; Case Code (Metric): 1608
C129-C134 C136 = CMP-2000-05393-2: as C214 on sheet JETSON; Voltage: 50V; Dielectric Material: Ceramic; Min Operating Temperature: -55°C; Depth: 0.5mm; Radiation Hardening: No; RoHS Compliant: Yes; Voltage Rating (DC): 50V; Lead Free: Lead Free; Resistor Type: Ceramic; Height: 0.5mm; Dielectric: X7R; Thickness: 0.022inch; Case/Package: 0402; Case Code (Metric): 1005; Termination: SMD/SMT; Capacitance: 100nF; Packaging: Tape and Reel; Max Operating Temperature: 125°C; Mount: Surface Mount; Package Quantity: 1; Width: 0.02inch; Weight: 2.3E-05oz; Voltage Rating: 50V; Tolerance: 10%; Construction: Flat; Case Code (Imperial): 0402; Length: 1mm; REACH SVHC: No SVHC; Series: C
D36 = CMP-004-00040-2: Led, Red/Grn, 180Mcd/230Mcd, 624Nm/525Nm Rohs Compliant: Yes; Source: rgled.SchLib; Component Type: Standard; Pins: 4; Design Item ID: CMP-004-00034-2
J7 = CMP-03365-000001-1: CONN EDGE DUAL FMALE 67POS 0.020; Manufacturer: TE; Number Of Contacts: 67; Current Rating: 0.5A; Pitch: 0.5mm; Conn Gender: Female; Is Female: yes; Voltage Rating: 50V; Conn Orientation: Right Angle; Automotive: No; Temperature Range High: +80°C; Package: 1-2199230-6; Category: Conn; Temperature: -40°C to +80°C; Number Of Rows: 2; ComponentLink2URL: http://www.te.com/commerce/DocumentDelivery/DDEController?Action=showdoc&DocId=Specification+Or+Standard%7F114-115006%7FB%7Fpdf%7FEnglish%7FENG_SS_114-115006_B_114-115006_REV_B.pdf%7F1-2199230-6; Manufacturer Part Number: 1-2199230-6; Height: 4.2mm; RoHS: TRUE; Footprint Url: http://www.te.com/commerce/DocumentDelivery/DDEController?Action=showdoc&DocId=Customer+Drawing%7F2199230%7FB2%7Fpdf%7FEnglish%7FENG_CD_2199230_B2.pdf%7F1-2199230-6; Digikey Description: CONN EDGE DUAL FMALE 67POS 0.020; Device Class L2: Card Edge Connectors; Contact Material: Gold,Tin; Device Class L1: Connectors; Device Class L3: unset; ComponentLink2Description: Datasheet; Temperature Range Low: -40°C; Octopart: https://octopart.com/1-2199230-6-te+connectivity-34969376; Lead Free: Yes
MP3 MP4 = CMP-03913-59774857-1: as MP1 on sheet JETSON; REACH SVHC: Unknown; NexarPartId: 59774857; RoHS: Compliant; Material: Steel; Packaging: Tape and Reel; Max Operating Temperature: 150°C; Min Operating Temperature: -55°C; Length: 2.5mm; Height: 2.5mm
R102 = CMP-2000-00443-2: RES SMD 33 OHM 1% 1/10W 0603; Voltage Rating (DC): 75V; Power Rating: 100mW; Resistance: 33R; Temperature Coefficient: 100ppm/°C; Min Operating Temperature: -55°C; Packaging: Tape and Reel; Mount: Surface Mount; Lead Free: Lead Free; Voltage Rating: 75V; Features: Automotive AEC-Q200; Height: 0.022inch; Width: 0.031inch; Number of Pins: 2; Package Quantity: 1; Case Code (Metric): 1608; Max Power Dissipation: 100mW; Case Code (Imperial): 0603; Termination: SMD/SMT; Resistance Tolerance: 1%; Max Operating Temperature: 155°C; Tolerance: 1%; Length: 1.6mm; Case/Package: 0603; Military Standard: Not; RoHS Compliant: Yes; Series: ERJ; Size Code: 0603; Construction: Rectangular; Number of Terminations: 2; Radiation Hardening: No; Resistor Type: Thick Film; Contact Plating: Tin; Depth: 0.8mm; REACH SVHC: No SVHC
R106-R108 R111-R113 R226 R227 R288 R289 R291 R292 R294 = CMP-009-00118-2: READ THE NAME; Pins: 2; Component Type: Standard; Design Item ID: CMP-009-00206-2; Source: 0402jump.SchLib
R109 R110 = CMP-2000-00213-2: Chip Resistor, 120 Ohm, +/- 1%, 0.1 W, -55 to 155 degC, 0603 (1608 Metric), RoHS, Tape and Reel; Manufacturer: Panasonic; Power Rating: 100mW; Voltage Rating (DC): 75V; Resistance: 120Ohm; Temperature Coefficient: 100ppm/degreesC; Number of Terminations: 2; Military Standard: Not; Tolerance: 1%; Min Operating Temperature: -55degC; Packaging: TapeandReel; Lead Free: LeadFree; Max Operating Temperature: 155degC; Manufacturer URL: http://www.panasonic.com/; Case Code (Imperial): 0603; REACH SVHC: NoSVHC; Width: 0.031inch; Datasheet URL: https://industrial.panasonic.com/cdbs/www-data/pdf/RDA0000/AOA0000C283.pdf; RoHSCompliant: true; Max Power Dissipation: 100mW; Termination: SMD/SMT; Package Reference: 0603; Height: 0.022inch; Depth: 0.8mm; Package Description: 2-Pin Surface Mount Device, Body 1.6 x 0.85 mm; Contact Plating: Tin; Length: 1.6mm; Package URL: http://www.st.com/st-web-ui/static/active/en/resource/technical/document/datasheet/CD00001320.pdf; Radiation Hardening: No; Package Quantity: 1; Number of Pins: 2; Datasheet Version: 42095.0; Voltage Rating: 75V; Composition: ThickFilm; Case/Package: 0603; Mount: SurfaceMount; Case Code (Metric): 1608
R290 R293 = CMP-1012-00623-3: as R62 on sheet JETSON; Number of Pins: 2; Package Reference: 603; Depth: 0.8mm; Mount: SurfaceMount; Package Description: 2-Pin Surface Mount Device, Body 1.6 x 0.85 mm; Datasheet Version: 02/2017; Length: 1.6mm; Lead Free: LeadFree; Height: 0.45mm; Number of Terminations: 2; Max Power Dissipation: 100mW; Min Operating Temperature: -55degC; Datasheet URL: https://industrial.panasonic.com/cdbs/www-data/pdf/RDA0000/AOA0000C304.pdf; Termination: SMD/SMT; Case Code (Metric): 1608; Case Code (Imperial): 0603; Tolerance: 1%; Max Operating Temperature: 155degC; RoHSCompliant: true; Voltage Rating (DC): 75V; Radiation Hardening: No; Packaging: TapeandReel; Composition: ThickFilm; Mounting Technology: SurfaceMount; Manufacturer URL: http://www.panasonic.com/; Width: 0.031inch; REACH SVHC: NoSVHC; Contact Plating: Tin; Military Standard: Not; Package Quantity: 1
TP9-TP11 = CMP-00025-2: Test Point .6mm
Y3 = CMP-27762-001115-1: XTAL OSC XO 32.7680KHZ CMOS SMD; Load Capacitance: 15pF; Max Supply Current: 3.5mA; Min Supply Voltage: 2.97V; Operating Supply Voltage: 3.3V; Frequency Stability: 25ppm; Lead Free: Lead Free; Case/Package: CSMD; Number of Pins: 4; Max Operating Temperature: 85°C; Packaging: Tape and Reel; Width: 0.079inch; Min Operating Temperature: -40°C; Radiation Hardening: No; Length: 2.5mm; Depth: 2mm; Termination: SMD/SMT; Height: 0.037inch; Series: ASDK; Frequency: 32.768kHz; Mount: Surface Mount

## Nets that join several sheets
3V3_AUX: JETSON (6 pins), NVME (21 pins)
GND: JETSON (126 pins), NVME (33 pins)
JETSON_1V8_REF: JETSON (24 pins), NVME (R290.2)
1V8_SMB_nALERT: JETSON (R176.1 U12.2), NVME (R291.2)
I2C1_SCL: JETSON (J1.189), NVME (R289.2)
I2C1_SDA: JETSON (J1.191), NVME (R288.2)
PCIE0_CLK_N: JETSON (D1.1 D1.10 J1.160), NVME (C137.2)
PCIE0_CLK_P: JETSON (D1.2 D1.9 J1.162), NVME (C138.2)
PCIE0_RX0_N: JETSON (D10.1 D10.10 J1.131), NVME (J7.41)
PCIE0_RX0_P: JETSON (D10.2 D10.9 J1.133), NVME (J7.43)
PCIE0_RX1_N: JETSON (D10.4 D10.7 J1.137), NVME (J7.29)
PCIE0_RX1_P: JETSON (D10.5 D10.6 J1.139), NVME (J7.31)
PCIE0_RX2_N: JETSON (D17.4 D17.7 J1.149), NVME (J7.17)
PCIE0_RX2_P: JETSON (D17.5 D17.6 J1.151), NVME (J7.19)
PCIE0_RX3_N: JETSON (D16.1 D16.10 J1.155), NVME (J7.5)
PCIE0_RX3_P: JETSON (D16.2 D16.9 J1.157), NVME (J7.7)
PCIE0_TX0_N: JETSON (D21.1 D21.10 J1.134), NVME (C128.2)
PCIE0_TX0_P: JETSON (D21.2 D21.9 J1.136), NVME (C135.2)
PCIE0_TX1_N: JETSON (D21.4 D21.7 J1.140), NVME (C123.2)
PCIE0_TX1_P: JETSON (D21.5 D21.6 J1.142), NVME (C124.2)
PCIE0_TX2_N: JETSON (D11.1 D11.10 J1.148), NVME (C121.2)
PCIE0_TX2_P: JETSON (D11.2 D11.9 J1.150), NVME (C122.2)
PCIE0_TX3_N: JETSON (D11.4 D11.7 J1.154), NVME (C119.2)
PCIE0_TX3_P: JETSON (D11.5 D11.6 J1.156), NVME (C120.2)
PCIE_32K_CLK: JETSON (R174.1 U11.4), NVME (R292.2)